# Altium project LimeSDR-QPCIe_1v2.PrjPcb (part 2 of 13)

## Sheet 06_LMS7002M_2_RF.SchDoc: LMS7002M #2 RF
size A3; Organization: Lime Microsystems; Address1: Surrey Tech Centre; Address2: Guildford GU2 7YG; Address3: Surrey; Address4: United Kingdom; Revision: v1.2; SheetNumber: 6; SheetTotal: 27
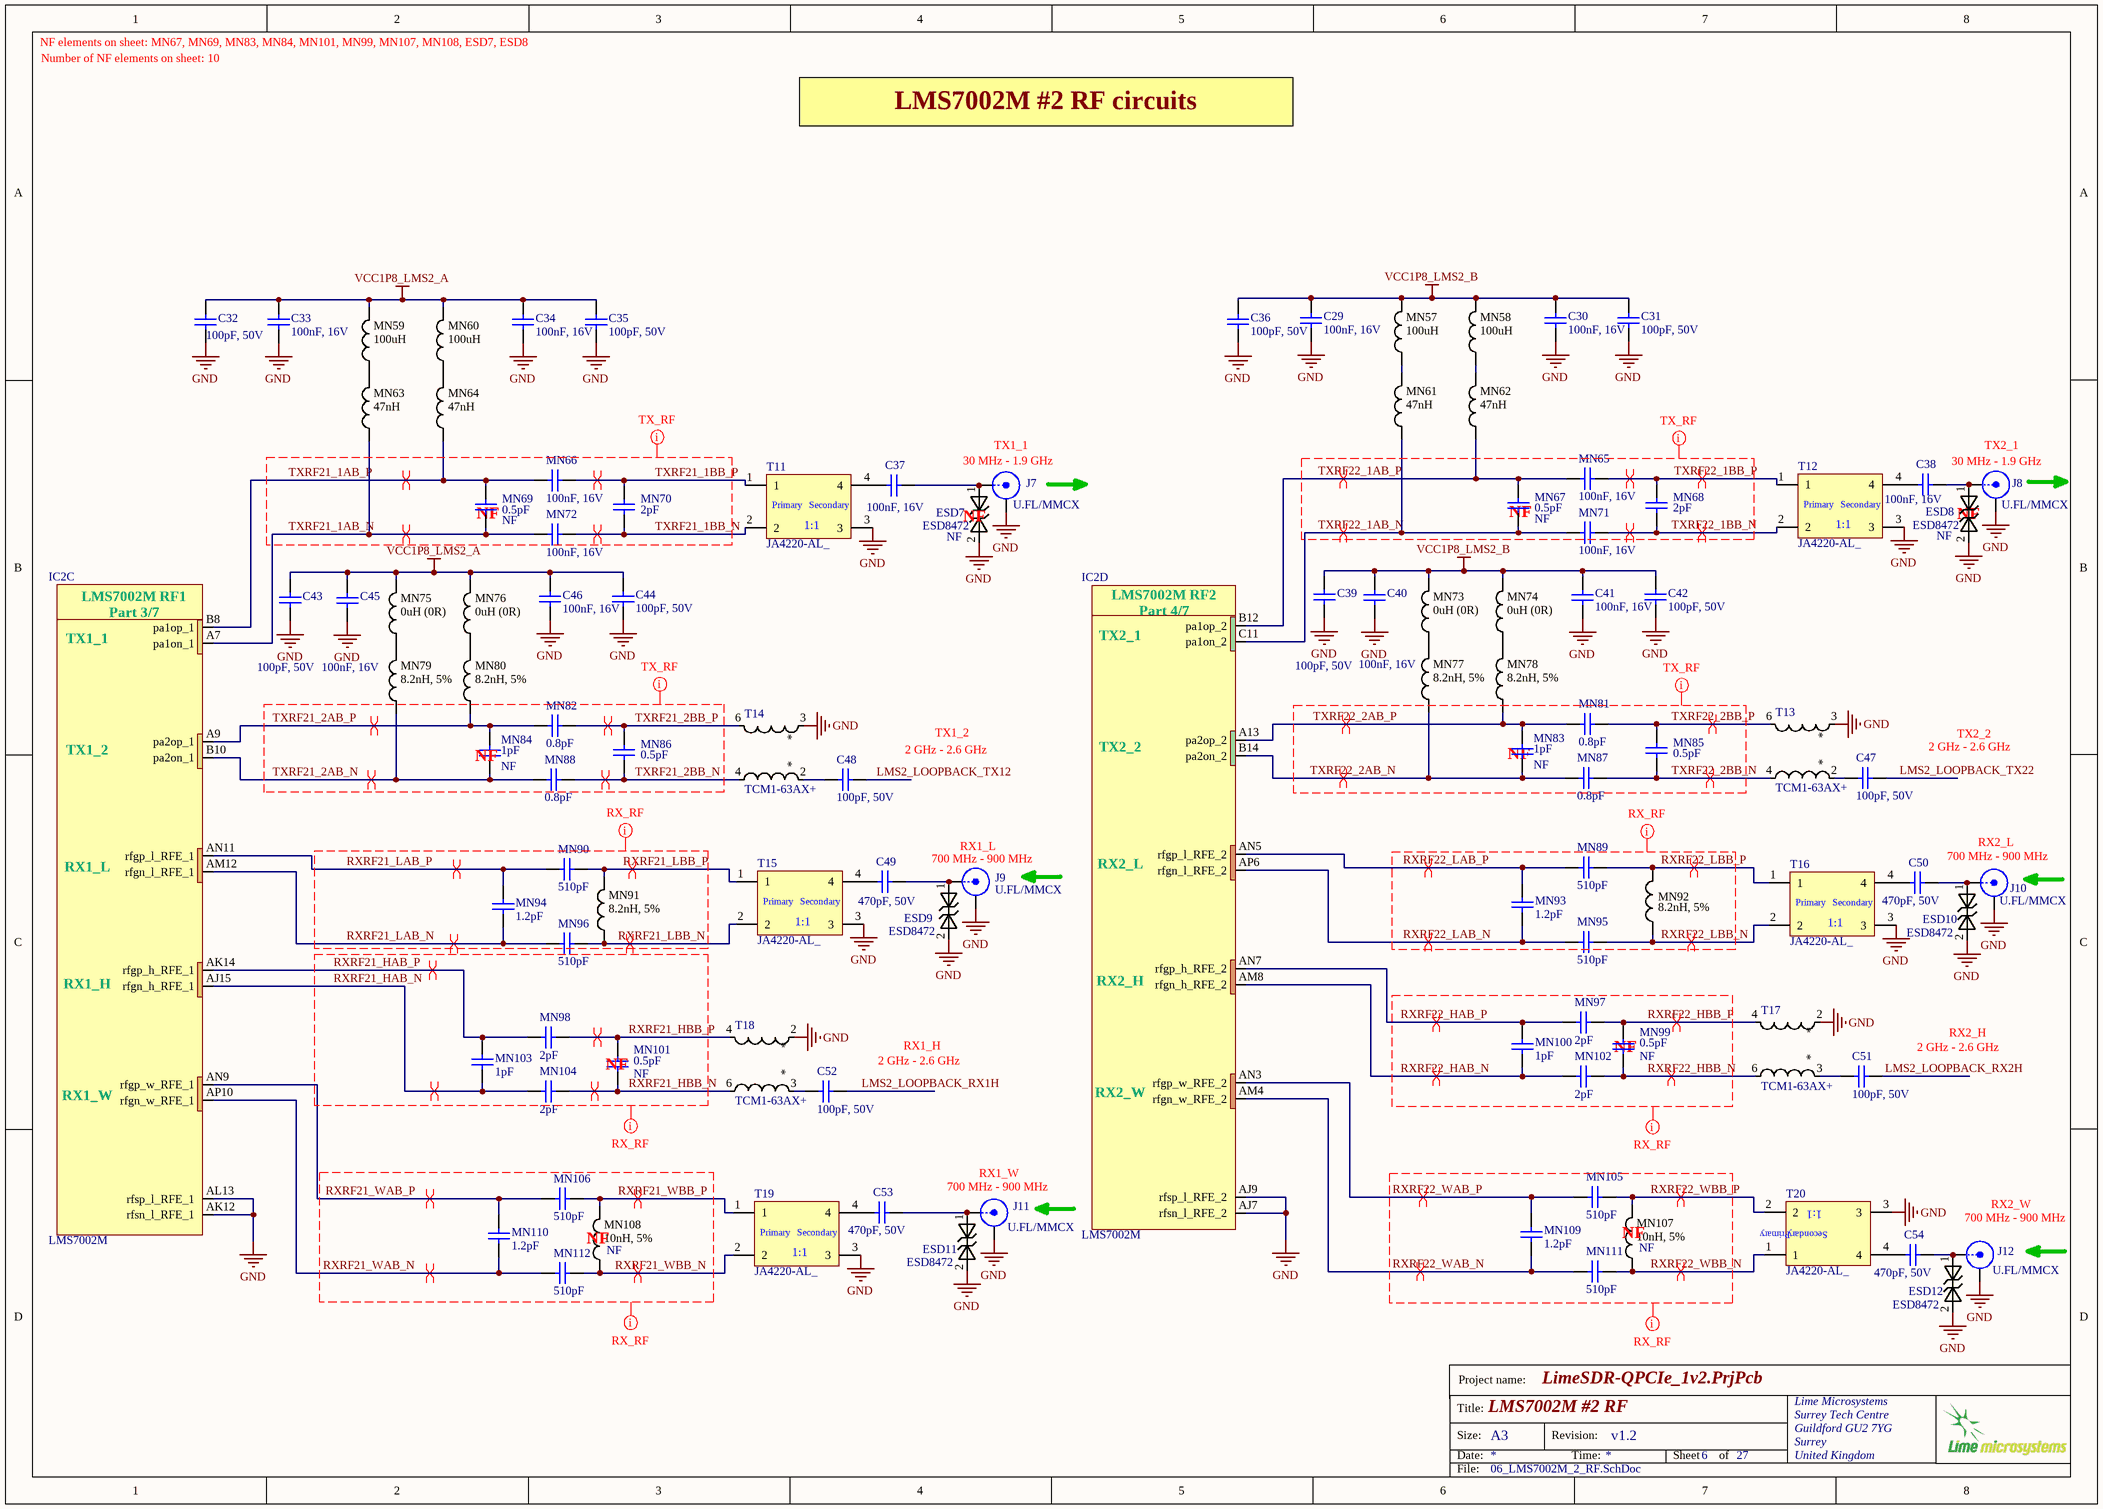
[diagram p5: 06_LMS7002M_2_RF.SchDoc]

### Parts
C29  100nF, 16V  [CAP0402]
C30  100nF, 16V  [CAP0402]
C31  100pF, 50V  [CAP0402]
C32  100pF, 50V  [CAP0402]
C33  100nF, 16V  [CAP0402]
C34  100nF, 16V  [CAP0402]
C35  100pF, 50V  [CAP0402]
C36  100pF, 50V  [CAP0402]
C37  100nF, 16V  [CAP0402]
C38  100nF, 16V  [CAP0402]
C39  100pF, 50V  [CAP0402]
C40  100nF, 16V  [CAP0402]
C41  100nF, 16V  [CAP0402]
C42  100pF, 50V  [CAP0402]
C43  100pF, 50V  [CAP0402]
C44  100pF, 50V  [CAP0402]
C45  100nF, 16V  [CAP0402]
C46  100nF, 16V  [CAP0402]
C47  100pF, 50V  [CAP0402]
C48  100pF, 50V  [CAP0402]
C49  470pF, 50V  [CAP0402]
C50  470pF, 50V  [CAP0402]
C51  100pF, 50V  [CAP0402]
C52  100pF, 50V  [CAP0402]
C53  470pF, 50V  [CAP0402]
C54  470pF, 50V  [CAP0402]
ESD7  ESD8472  Assembly Info: NF  [ESD8472_X3DFN2]
ESD8  ESD8472  Assembly Info: NF  [ESD8472_X3DFN2]
ESD9  ESD8472  [ESD8472_X3DFN2]
ESD10  ESD8472  [ESD8472_X3DFN2]
ESD11  ESD8472  [ESD8472_X3DFN2]
ESD12  ESD8472  [ESD8472_X3DFN2]
IC2  LMS7002M  [LMS7002M_v4]  (parts C,D of 7)
J7  U.FL/MMCX  [MMCX_UFL_conn_u]
J8  U.FL/MMCX  [MMCX_UFL_conn_u]
J9  U.FL/MMCX  [MMCX_UFL_conn_u]
J10  U.FL/MMCX  [MMCX_UFL_conn_u]
J11  U.FL/MMCX  [MMCX_UFL_conn_u]
J12  U.FL/MMCX  [MMCX_UFL_conn_u]
MN57  100uH  [RES0805]
MN58  100uH  [RES0805]
MN59  100uH  [RES0805]
MN60  100uH  [RES0805]
MN61  47nH  [RES0402]
MN62  47nH  [RES0402]
MN63  47nH  [RES0402]
MN64  47nH  [RES0402]
MN65  100nF, 16V  [CAP0402]
MN66  100nF, 16V  [CAP0402]
MN67  0.5pF  Assembly Info: NF  [CAP0402]
MN68  2pF  [CAP0402]
MN69  0.5pF  Assembly Info: NF  [CAP0402]
MN70  2pF  [CAP0402]
MN71  100nF, 16V  [CAP0402]
MN72  100nF, 16V  [CAP0402]
MN73  0uH (0R)  [RES0805]
MN74  0uH (0R)  [RES0805]
MN75  0uH (0R)  [RES0805]
MN76  0uH (0R)  [RES0805]
MN77  8.2nH, 5%  [RES0402]
MN78  8.2nH, 5%  [RES0402]
MN79  8.2nH, 5%  [RES0402]
MN80  8.2nH, 5%  [RES0402]
MN81  0.8pF  [CAP0402]
MN82  0.8pF  [CAP0402]
MN83  1pF  Assembly Info: NF  [CAP0402]
MN84  1pF  Assembly Info: NF  [CAP0402]
MN85  0.5pF  [CAP0402]
MN86  0.5pF  [CAP0402]
MN87  0.8pF  [CAP0402]
MN88  0.8pF  [CAP0402]
MN89  510pF  [CAP0402]
MN90  510pF  [CAP0402]
MN91  8.2nH, 5%  [RES0402]
MN92  8.2nH, 5%  [RES0402]
MN93  1.2pF  [CAP0402]
MN94  1.2pF  [CAP0402]
MN95  510pF  [CAP0402]
MN96  510pF  [CAP0402]
MN97  2pF  [CAP0402]
MN98  2pF  [CAP0402]
MN99  0.5pF  Assembly Info: NF  [CAP0402]
MN100  1pF  [CAP0402]
MN101  0.5pF  Assembly Info: NF  [CAP0402]
MN102  2pF  [CAP0402]
MN103  1pF  [CAP0402]
MN104  2pF  [CAP0402]
MN105  510pF  [CAP0402]
MN106  510pF  [CAP0402]
MN107  10nH, 5%  Assembly Info: NF  [RES0402]
MN108  10nH, 5%  Assembly Info: NF  [RES0402]
MN109  1.2pF  [CAP0402]
MN110  1.2pF  [CAP0402]
MN111  510pF  [CAP0402]
MN112  510pF  [CAP0402]
T11  JA4220-AL_  [JA4220-AL_]
T12  JA4220-AL_  [JA4220-AL_]
T13  TCM1-63AX+  [TCM1-63AX+_v2]
T14  TCM1-63AX+  [TCM1-63AX+_v2]
T15  JA4220-AL_  [JA4220-AL_]
T16  JA4220-AL_  [JA4220-AL_]
T17  TCM1-63AX+  [TCM1-63AX+_v2]
T18  TCM1-63AX+  [TCM1-63AX+_v2]
T19  JA4220-AL_  [JA4220-AL_]
T20  JA4220-AL_  [JA4220-AL_]

### Nets
GND: C29.1 C30.1 C31.2 C32.2 C33.1 C34.1 C35.2 C36.2 C39.2 C40.1 C41.1 C42.2 C43.2 C44.2 C45.1 C46.1 ESD7.2 ESD8.2 ESD9.2 ESD10.2 ESD11.2 ESD12.2 IC2.AJ7(rfsn_l_RFE_2) IC2.AJ9(rfsp_l_RFE_2) IC2.AK12(rfsn_l_RFE_1) IC2.AL13(rfsp_l_RFE_1) J7.2(Y) J8.2(Y) J9.2(Y) J10.2(Y) J11.2(Y) J12.2(Y) T11.3 T12.3 T13.3 T14.3 T15.3 T16.3 T17.2 T18.2 T19.3 T20.3
VCC1P8_LMS2_A: C32.1 C33.2 C34.2 C35.1 C43.1 C44.1 C45.2 C46.2 MN59.2 MN60.2 MN75.2 MN76.2
VCC1P8_LMS2_B: C29.2 C30.2 C31.1 C36.1 C39.1 C40.2 C41.2 C42.1 MN57.2 MN58.2 MN73.2 MN74.2
LMS2_LOOPBACK_RX1H: C52.1
LMS2_LOOPBACK_RX2H: C51.1
LMS2_LOOPBACK_TX12: C48.1
LMS2_LOOPBACK_TX22: C47.1
RXRF21_HAB_N: IC2.AJ15(rfgn_h_RFE_1) MN103.1 MN104.2
RXRF21_HAB_P: IC2.AK14(rfgp_h_RFE_1) MN98.2 MN103.2
RXRF21_HBB_N: MN101.1 MN104.1 T18.6
RXRF21_HBB_P: MN98.1 MN101.2 T18.4
RXRF21_LAB_N: IC2.AM12(rfgn_l_RFE_1) MN94.1 MN96.2
RXRF21_LAB_P: IC2.AN11(rfgp_l_RFE_1) MN90.2 MN94.2
RXRF21_LBB_N: MN91.1 MN96.1 T15.2
RXRF21_LBB_P: MN90.1 MN91.2 T15.1
RXRF21_WAB_N: IC2.AP10(rfgn_w_RFE_1) MN110.2 MN112.2
RXRF21_WAB_P: IC2.AN9(rfgp_w_RFE_1) MN106.2 MN110.1
RXRF21_WBB_N: MN108.1 MN112.1 T19.2
RXRF21_WBB_P: MN106.1 MN108.2 T19.1
RXRF22_HAB_N: IC2.AM8(rfgn_h_RFE_2) MN100.1 MN102.2
RXRF22_HAB_P: IC2.AN7(rfgp_h_RFE_2) MN97.2 MN100.2
RXRF22_HBB_N: MN99.1 MN102.1 T17.6
RXRF22_HBB_P: MN97.1 MN99.2 T17.4
RXRF22_LAB_N: IC2.AP6(rfgn_l_RFE_2) MN93.1 MN95.2
RXRF22_LAB_P: IC2.AN5(rfgp_l_RFE_2) MN89.2 MN93.2
RXRF22_LBB_N: MN92.1 MN95.1 T16.2
RXRF22_LBB_P: MN89.1 MN92.2 T16.1
RXRF22_WAB_N: IC2.AM4(rfgn_w_RFE_2) MN109.2 MN111.2
RXRF22_WAB_P: IC2.AN3(rfgp_w_RFE_2) MN105.2 MN109.1
RXRF22_WBB_N: MN107.1 MN111.1 T20.1
RXRF22_WBB_P: MN105.1 MN107.2 T20.2
TXRF21_1AB_N: IC2.A7(pa1on_1) MN63.1 MN69.1 MN72.1
TXRF21_1AB_P: IC2.B8(pa1op_1) MN64.1 MN66.2 MN69.2
TXRF21_1BB_N: MN70.1 MN72.2 T11.2
TXRF21_1BB_P: MN66.1 MN70.2 T11.1
TXRF21_2AB_N: IC2.B10(pa2on_1) MN79.1 MN84.2 MN88.2
TXRF21_2AB_P: IC2.A9(pa2op_1) MN80.1 MN82.2 MN84.1
TXRF21_2BB_N: MN86.1 MN88.1 T14.4
TXRF21_2BB_P: MN82.1 MN86.2 T14.6
TXRF22_1AB_N: IC2.C11(pa1on_2) MN61.1 MN67.1 MN71.1
TXRF22_1AB_P: IC2.B12(pa1op_2) MN62.1 MN65.2 MN67.2
TXRF22_1BB_N: MN68.1 MN71.2 T12.2
TXRF22_1BB_P: MN65.1 MN68.2 T12.1
TXRF22_2AB_N: IC2.B14(pa2on_2) MN77.1 MN83.2 MN87.2
TXRF22_2AB_P: IC2.A13(pa2op_2) MN78.1 MN81.2 MN83.1
TXRF22_2BB_N: MN85.1 MN87.1 T13.4
TXRF22_2BB_P: MN81.1 MN85.2 T13.6
NetC37_1: C37.1 ESD7.1 J7.1(X)
NetC37_2: C37.2 T11.4
NetC38_1: C38.1 ESD8.1 J8.1(X)
NetC38_2: C38.2 T12.4
NetC47_2: C47.2 T13.2
NetC48_2: C48.2 T14.2
NetC49_1: C49.1 ESD9.1 J9.1(X)
NetC49_2: C49.2 T15.4
NetC50_1: C50.1 ESD10.1 J10.1(X)
NetC50_2: C50.2 T16.4
NetC51_2: C51.2 T17.3
NetC52_2: C52.2 T18.3
NetC53_1: C53.1 ESD11.1 J11.1(X)
NetC53_2: C53.2 T19.4
NetC54_1: C54.1 ESD12.1 J12.1(X)
NetC54_2: C54.2 T20.4
NetMN57_1: MN57.1 MN61.2
NetMN58_1: MN58.1 MN62.2
NetMN59_1: MN59.1 MN63.2
NetMN60_1: MN60.1 MN64.2
NetMN73_1: MN73.1 MN77.2
NetMN74_1: MN74.1 MN78.2
NetMN75_1: MN75.1 MN79.2
NetMN76_1: MN76.1 MN80.2

### Layout directives
differential pair: RXRF21_HAB_N, RXRF21_HAB_P, RXRF21_HBB_N, RXRF21_HBB_P, RXRF21_LAB_N, RXRF21_LAB_P, RXRF21_LBB_N, RXRF21_LBB_P, RXRF21_WAB_N, RXRF21_WAB_P, RXRF21_WBB_N, RXRF21_WBB_P, RXRF22_HAB_N, RXRF22_HAB_P, RXRF22_HBB_N, RXRF22_HBB_P, RXRF22_LAB_N, RXRF22_LAB_P, RXRF22_LBB_N, RXRF22_LBB_P, RXRF22_WAB_N, RXRF22_WAB_P, RXRF22_WBB_N, RXRF22_WBB_P, TXRF21_1AB_N, TXRF21_1AB_P, TXRF21_1BB_N, TXRF21_1BB_P, TXRF21_2AB_N, TXRF21_2AB_P, TXRF21_2BB_N, TXRF21_2BB_P, TXRF22_1AB_N, TXRF22_1AB_P, TXRF22_1BB_N, TXRF22_1BB_P, TXRF22_2AB_N, TXRF22_2AB_P, TXRF22_2BB_N, TXRF22_2BB_P
net class TX_RF: TXRF21_1AB_N, TXRF21_1AB_P, TXRF21_1BB_N, TXRF21_1BB_P, TXRF21_2AB_N, TXRF21_2AB_P, TXRF21_2BB_N, TXRF21_2BB_P, TXRF22_1AB_N, TXRF22_1AB_P, TXRF22_1BB_N, TXRF22_1BB_P, TXRF22_2AB_N, TXRF22_2AB_P, TXRF22_2BB_N, TXRF22_2BB_P
net class RX_RF: RXRF21_HAB_N, RXRF21_HAB_P, RXRF21_HBB_N, RXRF21_HBB_P, RXRF21_LAB_N, RXRF21_LAB_P, RXRF21_LBB_N, RXRF21_LBB_P, RXRF21_WAB_N, RXRF21_WAB_P, RXRF21_WBB_N, RXRF21_WBB_P, RXRF22_HAB_N, RXRF22_HAB_P, RXRF22_HBB_N, RXRF22_HBB_P, RXRF22_LAB_N, RXRF22_LAB_P, RXRF22_LBB_N, RXRF22_LBB_P, RXRF22_WAB_N, RXRF22_WAB_P, RXRF22_WBB_N, RXRF22_WBB_P

### Notes on the sheet
- NF elements on sheet: MN67, MN69, MN83, MN84, MN101, MN99, MN107, MN108, ESD7, ESD8
- Number of NF elements on sheet: 10
- LMS7002M #2 RF circuits
- TX1_1
- TX2_1
- (near MN69) NF
- 30 MHz - 1.9 GHz
- (near MN67) NF
- NF
- (near ESD7) NF
- (near MN84) NF
- 2 GHz - 2.6 GHz
- TX1_2
- (near MN83) NF
- TX2_2
- RX1_L
- RX2_L
- 700 MHz - 900 MHz
- RX1_H
- (near MN99) NF
- (near C51) 2 GHz - 2.6 GHz
- RX2_H
- (near MN101) NF
- (near C52) 2 GHz - 2.6 GHz
- RX1_W
- (near MN108) NF
- (near MN107) NF
- RX2_W
- Project name:
- Title:
- Size:
- Date:
- A3
- Revision:
- Time:
- Sheet
- of
- File:
- (in symbol JA4220-AL_) Primary; Secondary; 1:1
- (in symbol LMS7002Mr3, part C) LMS7002M RF1; Part 3/7; TX1_1; TX1_2; RX1_L; RX1_H; RX1_W
- (in symbol LMS7002Mr3, part D) LMS7002M RF2; Part 4/7; TX2_1; TX2_2; RX2_L; RX2_H; RX2_W

### Library data of the parts
C29 C30 C33 C34 C37 C38 C40 C41 C45 C46 = Cap_0402: Manufacturer: Murata Electronics; Manufacturer Part Number: GRM155R71C104KA88D; Part Description: 0.10µF ±10% 16V Ceramic Capacitor X7R 0402 (1005 Metric); Tolerance: 10 %; Type: General Purpose MLCC; Capacitance: 0.1 uF; Case Length: 1 mm; Dielectric: X7R; Case Height: 0.5 mm; Temperature Coefficient / Code: +/- 15 %; Value: 100nF, 16V; Supplier 1: Mouser; Supplier Part Number 1: 81-GRM155R71C104KA88; Case Code - in: 0402; RoHS: RoHS Compliant; Operating Temperature Range: - 55 C to + 125 C; Series: GRM; Termination Style: SMD/SMT; Package / Case: 0402 (1005 metric); Voltage Rating DC: 16 V; Maximum Operating Temperature: + 125 C; Case Code - mm: 1005; Minimum Operating Temperature: - 55 C; Product Category: Low & Medium Capacitance SMD Ceramic Chip Capacitors; Packaging: Reel; Product: General Type MLCCs; Category: Multilayer Ceramic Capacitors MLCC - SMD/SMT; Brand: Murata Electronics; Case Width: 0.5 mm; RoHS - Mouser: Y; Standard Pack Qty: 10000; Minimum Order Quantity: 1; Reeling: True; Manufacturer Part Number 1: GRM155R71C104KA88D
C31 C32 C35 C36 C39 C42-C44 = Cap_0402: Manufacturer: Yageo; Manufacturer Part Number 1: CC0402JRNPO9BN101; Part Description: 100pF ±5% 50V C0G, NP0 Ceramic Capacitor -55°C ~ 125°C Surface Mount, MLCC 0402 (1005 Metric) 0.039" L x 0.020" W (1.00mm x 0.50mm); Temperature Coefficient: C0G, NP0; Tolerance: ±5%; Value: 100pF, 50V; Supplier 1: Digi-Key; Supplier Part Number 1: 311-1024-1-ND; Category: Capacitors; Features: -; Operating Temperature: -55°C ~ 125°C; Capacitance: 100pF; Thickness (Max): 0.022" (0.55mm); RoHS: RoHS Compliant; Voltage - Rated: 50V; Lead Style: -; Ratings: -; Size / Dimension: 0.039" L x 0.020" W (1.00mm x 0.50mm); Height - Seated (Max): -; Applications: General Purpose; Package / Case: 0402 (1005 Metric); Lead Spacing: -; Packaging: Tape & Reel (TR); Mounting Type: Surface Mount, MLCC
C47 C48 C51 C52 = Cap_0402: Manufacturer Part Number 1: CC0402JRNPO9BN101; Manufacturer: Yageo; Part Description: 100pF ±5% 50V C0G, NP0 Ceramic Capacitor -55°C ~ 125°C Surface Mount, MLCC 0402 (1005 Metric) 0.039" L x 0.020" W (1.00mm x 0.50mm); Tolerance: ±5%; Temperature Coefficient: C0G, NP0; Value: 100pF, 50V; Capacitance: 100pF; Thickness (Max): 0.022" (0.55mm); Size / Dimension: 0.039" L x 0.020" W (1.00mm x 0.50mm); RoHS: RoHS Compliant; Ratings: -; Package / Case: 0402 (1005 Metric); Mounting Type: Surface Mount, MLCC; Height - Seated (Max): -; Features: -; Lead Spacing: -; Voltage - Rated: 50V; Operating Temperature: -55°C ~ 125°C; Packaging: Cut Tape (CT); Applications: General Purpose; Lead Style: -; Supplier 1: Digi-Key; Category: Capacitors; Supplier Part Number 1: 311-1024-1-ND
C49 C50 C53 C54 = Cap_0402: Manufacturer Part Number: C1005C0G1H471J050BA; Manufacturer: TDK Corporation; Part Description: 470pF ±5% 50V Ceramic Capacitor C0G, NP0 0402 (1005 Metric); Tolerance: ±5%; Temperature Coefficient: C0G, NP0; Value: 470pF, 50V; Supplier 1: Digi-Key; Supplier Part Number 1: 445-2656-6-ND; Ratings: -; Package / Case: 0402 (1005 Metric); Capacitance: 470pF; Packaging: Digi-Reel®; RoHS: RoHS Compliant; Lead Style: -; Thickness (Max): 0.022" (0.55mm); Size / Dimension: 0.039" L x 0.020" W (1.00mm x 0.50mm); Lead Spacing: -; Operating Temperature: -55°C ~ 125°C; Height - Seated (Max): -; Applications: General Purpose; Mounting Type: Surface Mount, MLCC; Voltage - Rated: 50V; Category: Capacitors; Features: -
ESD7-ESD12 = ESD8472: Manufacturer: ON Semiconductor; Manufacturer Part Number: ESD8472MUT5G; Part Description: TVS DIODE 5.3VWM 14VC X3DFN2; Voltage - Reverse Standoff (Typ): 5.3V (Max); Voltage - Breakdown (Min): 7V; Voltage - Clamping (Max) @ Ipp: 14V; Current - Peak Pulse (10/1000µs): 3A (8/20µs); Power Line Protection: No; Capacitance @ Frequency: 0.2pF @ 1MHz; Supplier 1: Digi-Key; RoHS: RoHS Compliant; Category: Circuit Protection; Stock 1: 2295; Pricing 1: 1=0.39, 10=0.315, 100=0.2142, 500=0.16068, 1000=0.12051 (USD); Packaging: Cut Tape (CT); Part Status: Active; Type: Zener; Power - Peak Pulse: -; Applications: Automotive, RF Antenna; Operating Temperature: -55°C ~ 150°C (TJ); Mounting Type: Surface Mount; Package / Case: 2-XFDFN; Supplier Device Package: 2-X3DFN (0.62x0.32); ComponentLink1URL: http://www.onsemi.com/pub/Collateral/ESD8472-D.PDF; ComponentLink1Description: http://www.onsemi.com/pub/Collateral/ESD8472-D.PDF; Supplier Part Number 1: ESD8472MUT5GOSCT-ND
IC2 = LMS7002Mr3: as IC1 on sheet 04_LMS7002M_Digital; Supplier 1: Lime Microsystems; Supplier Part Number 1: LMS7002M; Manufacturer Part Number 1: LMS7002M
J7-J12 = RF_IF_connector: CONN UMC RCPT STR 50 OHM SMD; Manufacturer: Molex, LLC; Manufacturer Part Number 1: 0734120110; Part Description: Ultra Miniature Coaxial Connector Receptacle, Male Pin 50 Ohm Surface Mount Solder; Body Finish: Nickel; Body Material: Phosphor Bronze; Center Contact Material: Brass; Center Contact Plating: Gold; Connector Style: Ultra Miniature Coaxial; Connector Type: Jack, Male Pin; Contact Termination: Solder; Dielectric Material: Liquid Crystal Polymer (LCP); Frequency - Max: 6GHz; Impedance: 50 Ohm; Voltage Rating: 60V; Cable Group: -; Category: Connectors, Interconnects; Fastening Type: Snap-On; Features: -; Housing Color: Silver; Ingress Protection: -; Mounting Type: Surface Mount; Operating Temperature: -40°C ~ 90°C; Packaging: Cut Tape (CT); RoHS: RoHS Compliant; Shield Termination: Solder; Supplier 1: Digi-Key; Supplier Part Number 1: WM5587CT-ND
MN57-MN60 = Inductor_0603: Manufacturer: TDK Corporation; Manufacturer Part Number: MLF2012C101KT000; Part Description: 100µH Shielded Multilayer Inductor 2mA 3.1 Ohm Max 0805 (2012 Metric); Q @ Freq: 25 @ 1MHz; Shielding: Shielded; Current Rating: 2mA; Frequency - Self Resonant: 7MHz; Frequency - Test: 1MHz; Material - Core: Ferrite; Tolerance: ±10%; Inductance: 100µH; DC Resistance (DCR): 3.1 Ohm Max; Value: 100uH; Supplier 1: Digi-Key; Supplier Part Number 1: 445-1071-1-ND; Supplier Device Package: 0805 (2012 Metric); Size / Dimension: 0.079" L x 0.049" W (2.00mm x 1.25mm); Operating Temperature: -40°C ~ 85°C; Packaging: Cut Tape (CT); RoHS: RoHS Compliant; Current - Saturation: -; Height - Seated (Max): 0.057" (1.45mm); Package / Case: 0805 (2012 Metric); Mounting Type: Surface Mount; Type: Multilayer; Category: Inductors, Coils, Chokes
MN61-MN64 = Inductor_0603: Manufacturer: COILCRAFT; Manufacturer Part Number: 0402HP-47NXJLU; Part Description: COILCRAFT  0402HP-47NXJLU  Surface Mount High Frequency Inductor, 0402HP Series, 47 nH, 420 mA, 0402 [1005 Metric], Wirewound; SVHC: No SVHC (15-Jun-2015); Inductance Tolerance: ± 5%; High Frequency Inductor Case: 0402 [1005 Metric]; Inductor Case Style: 0402 [1005 Metric]<!--FANDB--><div class="features-and-benefits-container"></div>; Inductance: 47; DC Resistance Max: 0.58; Self Resonant Frequency Min: 2.4; Product Range: 0402; DC Current Rating: 420; Inductor Construction: Wirewound; Supplier 1: Farnell; Supplier Part Number 1: 2285856; Packaging: Cut Tape; RoHS: Y-EX; value: 47nH; Manufacturer Part Number 1: 0402HP-47NXJLU
MN65 MN66 MN71 MN72 = Cap_0402: Manufacturer: Murata Electronics; Manufacturer Part Number: GRM155R71C104KA88D; Part Description: 0.10µF ±10% 16V Ceramic Capacitor X7R 0402 (1005 Metric); Tolerance: 10 %; Capacitance: 0.1 uF; Case Length: 1 mm; Dielectric: X7R; Case Height: 0.5 mm; Temperature Coefficient / Code: +/- 15 %; Value: 100nF, 16V; Supplier 1: Mouser; Supplier Part Number 1: 81-GRM155R71C104KA88; Case Code - in: 0402; RoHS: RoHS Compliant; Operating Temperature Range: - 55 C to + 125 C; Series: GRM; Termination Style: SMD/SMT; Package / Case: 0402 (1005 metric); Voltage Rating DC: 16 V; Type: General Purpose MLCC; Maximum Operating Temperature: + 125 C; Case Code - mm: 1005; Minimum Operating Temperature: - 55 C; Product Category: Low & Medium Capacitance SMD Ceramic Chip Capacitors; Packaging: Reel; Product: General Type MLCCs; Category: Multilayer Ceramic Capacitors MLCC - SMD/SMT; Brand: Murata Electronics; Case Width: 0.5 mm; RoHS - Mouser: Y; Standard Pack Qty: 10000; Minimum Order Quantity: 1; Reeling: True; Manufacturer Part Number 1: GRM155R71C104KA88D
MN67 MN69 MN85 MN86 MN99 MN101 = Cap_0402: Manufacturer: Yageo; Manufacturer Part Number 1: CC0402CRNPO9BNR50; Part Description: 0.50pF ±0.25pF 50V Ceramic Capacitor C0G, NP0 0402 (1005 Metric); Capacitance: 0.50pF; Voltage - Rated: 50V; Temperature Coefficient: C0G, NP0; Tolerance: ±0.25pF; Value: 0.5pF; Supplier 1: Digi-Key; Supplier Part Number 1: 311-1001-1-ND; RoHS: RoHS Compliant; Thickness (Max): 0.022" (0.55mm); Features: -; Height - Seated (Max): -; Lead Spacing: -; Applications: General Purpose; Packaging: Cut Tape (CT); Ratings: -; Size / Dimension: 0.039" L x 0.020" W (1.00mm x 0.50mm); Lead Style: -; Mounting Type: Surface Mount, MLCC; Operating Temperature: -55°C ~ 125°C; Package / Case: 0402 (1005 Metric); Category: Capacitors
MN68 MN70 MN97 MN98 MN102 MN104 = Cap_0402: Manufacturer: AVX; Manufacturer Part Number 1: 04025U2R0BAT2A; Part Description: 2pF ±0.1pF 50V Ceramic Capacitor C0G, NP0 0402 (1005 Metric); Product Range: U Series; Voltage Rating: 50; SVHC: No SVHC (17-Dec-2014); Capacitance Tolerance: ± 0.1; Ceramic Capacitor Case: 0402 [1005 Metric]; Capacitance: 2; Dielectric Characteristic: C0G / NP0; Value: 2pF; Supplier 1: Farnell; Supplier Part Number 1: 2332536; Operating Temperature Max: 125; RoHS: YES; Operating Temperature Min: -55; Capacitance Tolerance ±: ± 0.1; Packaging: Cut Tape; MSL: MSL 1 - Unlimited
MN73-MN76 = Inductor_0603: Manufacturer: BOURNS; Manufacturer Part Number 1: CR0805-J/-000ELF; Part Description: RES SMD 0.0 OHM JUMPER 1/8W 0805; Value: 0uH (0R); Supplier 1: Farnell; Supplier Part Number 1: 2008388; RoHS: YES
MN77-MN80 MN91 MN92 = Inductor_0603: Manufacturer: COILCRAFT; Manufacturer Part Number 1: 0402HP-8N2XJLU; Part Description: Surface Mount High Frequency Inductor, 0402HP Series, 8.2 nH, 1.5 A, 0402 [1005 Metric], Wirewound; Inductor Construction: Wirewound; DC Current Rating: 1.5; Inductor Case Style: 0402 [1005 Metric]<!--FANDB--><div class="features-and-benefits-container"></div>; Self Resonant Frequency Min: 5.4; DC Resistance Max: 0.065; High Frequency Inductor Case: 0402 [1005 Metric]; SVHC: No SVHC (16-Jun-2014); Inductance: 8.2; Supplier 1: Farnell; Supplier Part Number 1: 2285826; Packaging: Cut Tape; Product Range: COILCRAFT - 0402; Inductance Tolerance: ± 5%; RoHS: Y-EX; Value: 8.2nH, 5%
MN81 MN82 MN87 MN88 = Cap_0402: Manufacturer: Murata Electronics North America; Manufacturer Part Number 1: GRM1555C1HR80BA01D; Part Description: 0.80pF ±0.1pF 50V Ceramic Capacitor C0G, NP0 0402 (1005 Metric); Temperature Coefficient: C0G, NP0; Capacitance: 0.80pF; Voltage - Rated: 50V; Tolerance: ±0.1pF; Value: 0.8pF; Applications: General Purpose; Operating Temperature: -55°C ~ 125°C; Size / Dimension: 0.039" L x 0.020" W (1.00mm x 0.50mm); Features: -; Supplier 1: Digi-Key; Height - Seated (Max): -; Category: Capacitors; Package / Case: 0402 (1005 Metric); Mounting Type: Surface Mount, MLCC; Lead Spacing: -; Thickness (Max): 0.022" (0.55mm); RoHS: RoHS Compliant; Supplier Part Number 1: 490-6269-1-ND; Packaging: Cut Tape (CT); Ratings: -; Lead Style: -
MN83 MN84 MN100 MN103 = Cap_0402: Manufacturer: TDK Corporation; Manufacturer Part Number 1: C1005C0G1H010B050BA; Part Description: 1pF ±0.1pF 50V Ceramic Capacitor C0G, NP0 0402 (1005 Metric); Voltage - Rated: 50V; Temperature Coefficient: C0G, NP0; Tolerance: ±0.1pF; Value: 1pF; Supplier 1: Digi-Key; Supplier Part Number 1: 445-4854-6-ND; Size / Dimension: 0.039" L x 0.020" W (1.00mm x 0.50mm); Lead Spacing: -; Operating Temperature: -55°C ~ 125°C; Thickness (Max): 0.022" (0.55mm); Package / Case: 0402 (1005 Metric); Features: -; Lead Style: -; Applications: General Purpose; Height - Seated (Max): -; Capacitance: 1pF; RoHS: RoHS Compliant; Mounting Type: Surface Mount, MLCC; Packaging: Digi-Reel®; Ratings: -; Category: Capacitors
MN89 MN90 MN95 MN96 MN105 MN106 MN111 MN112 = Cap_0402: Manufacturer: Murata Electronics North America; Manufacturer Part Number 1: GRM1555C1H511JA01D; Part Description: 510pF ±5% 50V Ceramic Capacitor C0G, NP0 0402 (1005 Metric); Voltage - Rated: 50V; Temperature Coefficient: C0G, NP0; Tolerance: ±5%; Value: 510pF; Supplier 1: Digi-Key; Supplier Part Number 1: 490-3237-1-ND; Height - Seated (Max): -; Features: -; Size / Dimension: 0.039" L x 0.020" W (1.00mm x 0.50mm); Applications: General Purpose; Lead Spacing: -; Package / Case: 0402 (1005 Metric); Ratings: -; Thickness (Max): 0.022" (0.55mm); Lead Style: -; Operating Temperature: -55°C ~ 125°C; Mounting Type: Surface Mount, MLCC; Capacitance: 510pF; Category: Capacitors; RoHS: RoHS Compliant; Packaging: Cut Tape (CT)
MN93 MN94 MN109 MN110 = Cap_0402: Manufacturer: Murata Electronics North America; Manufacturer Part Number 1: GRM1555C1H1R2CA01D; Part Description: 1.2pF ±0.25pF 50V Ceramic Capacitor C0G, NP0 0402 (1005 Metric); Temperature Coefficient: C0G, NP0; Voltage - Rated: 50V; Tolerance: ±0.25pF; Value: 1.2pF; Supplier 1: Digi-Key; Supplier Part Number 1: 490-5927-1-ND; Lead Style: -; Category: Capacitors; Features: -; Packaging: Cut Tape (CT); Operating Temperature: -55°C ~ 125°C; Package / Case: 0402 (1005 Metric); Applications: General Purpose; Size / Dimension: 0.039" L x 0.020" W (1.00mm x 0.50mm); Lead Spacing: -; Ratings: -; Mounting Type: Surface Mount, MLCC; RoHS: RoHS Compliant; Height - Seated (Max): -; Thickness (Max): 0.022" (0.55mm); Capacitance: 1.2pF
MN107 MN108 = Inductor_0603: Manufacturer: COILCRAFT; Part Description: Surface Mount High Frequency Inductor, 0402HP Series, 10 nH, 1.3 A, 0402 [1005 Metric], Wirewound; Manufacturer Part Number 1: 0402HP-10NXJLU; Value: 10nH, 5%; Supplier 1: Farnell; Supplier Part Number 1: 2285830; RoHS: Y-EX
T11 T12 T15 T16 T19 T20 = JA4220-AL_: Part Description: RF balun; 1:1 ratio; 3 dB bandwidth: 0.1 MHz to 3.5 GHz; 3.8mm x 3.8mm; Manufacturer: Coilcraft; Supplier 1: Coilcraft; Supplier Part Number: JA4220-AL_; Supplier Part Number 1: JA4220-AL_
T13 T14 T17 T18 = Balun_v2: Manufacturer: Mini-circuits; Part Description: BALUN WIDE BAND; Manufacturer Part Number 1: TCM1-63AX+; Supplier 1: Mini-circuits; Supplier Part Number 1: TCM1-63AX+

## Sheet 07_LMS7002M_1_Power.SchDoc: LMS7002M #1 power supply
size A3 portrait; Organization: Lime Microsystems; Address1: Surrey Tech Centre; Address2: Guildford GU2 7YG; Address3: Surrey; Address4: United Kingdom; Revision: v1.2; SheetNumber: 7; SheetTotal: 27; PageSetup: Record=PageOptions|CenterHorizontal=True|CenterVertical=True|PrintScale=0.70|XCorrection=1.00|YCorrection=1.00|PrintKind=1|BorderSize=5000000|LeftOffset=0|BottomOffset=0|Orientation=1|PaperLength=2970|PaperWidth=2100|Scale=100|PaperSource=7|PrintQuality=600|MediaType=1|DitherType=10|PrintScaleMode=1|PaperKind=A4|PaperIndex=9
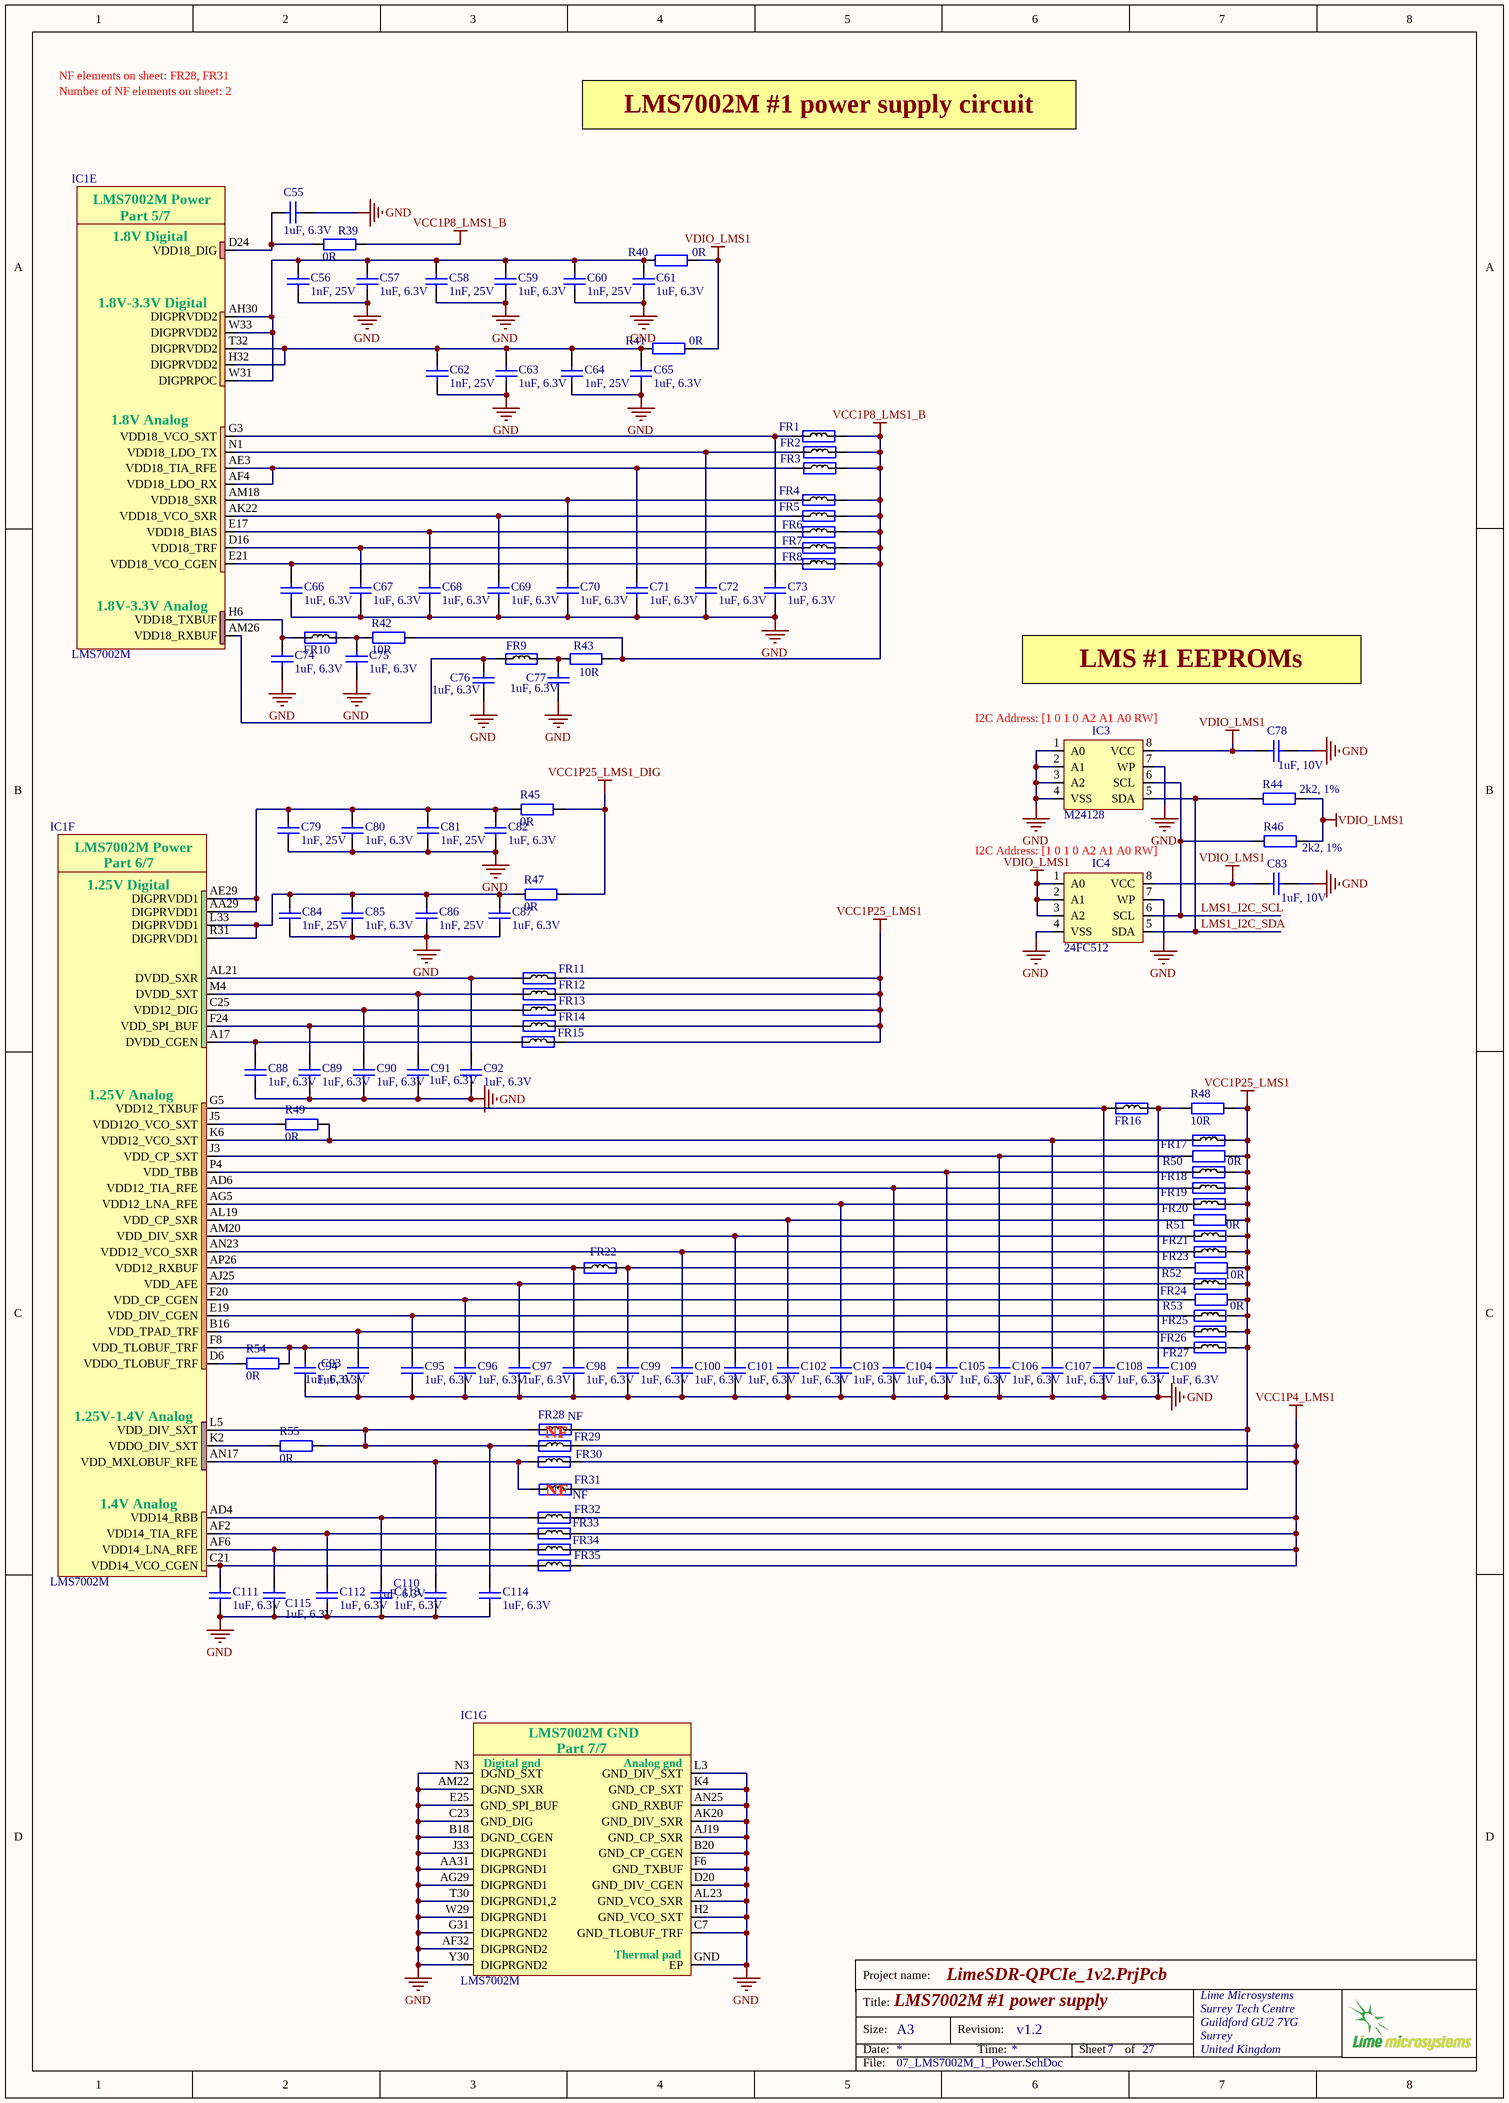
[diagram p6: 07_LMS7002M_1_Power.SchDoc]

### Parts
C55  1uF, 6.3V  [CAP0201]
C56  1nF, 25V  [CAP0201]
C57  1uF, 6.3V  [CAP0201]
C58  1nF, 25V  [CAP0201]
C59  1uF, 6.3V  [CAP0201]
C60  1nF, 25V  [CAP0201]
C61  1uF, 6.3V  [CAP0201]
C62  1nF, 25V  [CAP0201]
C63  1uF, 6.3V  [CAP0201]
C64  1nF, 25V  [CAP0201]
C65  1uF, 6.3V  [CAP0201]
C66  1uF, 6.3V  [CAP0201]
C67  1uF, 6.3V  [CAP0201]
C68  1uF, 6.3V  [CAP0201]
C69  1uF, 6.3V  [CAP0201]
C70  1uF, 6.3V  [CAP0201]
C71  1uF, 6.3V  [CAP0201]
C72  1uF, 6.3V  [CAP0201]
C73  1uF, 6.3V  [CAP0201]
C74  1uF, 6.3V  [CAP0201]
C75  1uF, 6.3V  [CAP0201]
C76  1uF, 6.3V  [CAP0201]
C77  1uF, 6.3V  [CAP0201]
C78  1uF, 10V  [CAP0402]
C79  1nF, 25V  [CAP0201]
C80  1uF, 6.3V  [CAP0201]
C81  1nF, 25V  [CAP0201]
C82  1uF, 6.3V  [CAP0201]
C83  1uF, 10V  [CAP0402]
C84  1nF, 25V  [CAP0201]
C85  1uF, 6.3V  [CAP0201]
C86  1nF, 25V  [CAP0201]
C87  1uF, 6.3V  [CAP0201]
C88  1uF, 6.3V  [CAP0201]
C89  1uF, 6.3V  [CAP0201]
C90  1uF, 6.3V  [CAP0201]
C91  1uF, 6.3V  [CAP0201]
C92  1uF, 6.3V  [CAP0201]
C93  1uF, 6.3V  [CAP0201]
C94  1uF, 6.3V  [CAP0201]
C95  1uF, 6.3V  [CAP0201]
C96  1uF, 6.3V  [CAP0201]
C97  1uF, 6.3V  [CAP0201]
C98  1uF, 6.3V  [CAP0201]
C99  1uF, 6.3V  [CAP0201]
C100  1uF, 6.3V  [CAP0201]
C101  1uF, 6.3V  [CAP0201]
C102  1uF, 6.3V  [CAP0201]
C103  1uF, 6.3V  [CAP0201]
C104  1uF, 6.3V  [CAP0201]
C105  1uF, 6.3V  [CAP0201]
C106  1uF, 6.3V  [CAP0201]
C107  1uF, 6.3V  [CAP0201]
C108  1uF, 6.3V  [CAP0201]
C109  1uF, 6.3V  [CAP0201]
C110  1uF, 6.3V  [CAP0201]
C111  1uF, 6.3V  [CAP0201]
C112  1uF, 6.3V  [CAP0201]
C113  1uF, 6.3V  [CAP0201]
C114  1uF, 6.3V  [CAP0201]
C115  1uF, 6.3V  [CAP0201]
FR1  Ferrite  [RES0201]  (value not drawn)
FR2  Ferrite  [RES0201]  (value not drawn)
FR3  Ferrite  [RES0201]  (value not drawn)
FR4  Ferrite  [RES0201]  (value not drawn)
FR5  Ferrite  [RES0201]  (value not drawn)
FR6  Ferrite  [RES0201]  (value not drawn)
FR7  Ferrite  [RES0201]  (value not drawn)
FR8  Ferrite  [RES0201]  (value not drawn)
FR9  Ferrite  [RES0201]  (value not drawn)
FR10  Ferrite  [RES0201]  (value not drawn)
FR11  Ferrite  [RES0201]  (value not drawn)
FR12  Ferrite  [RES0201]  (value not drawn)
FR13  Ferrite  [RES0201]  (value not drawn)
FR14  Ferrite  [RES0201]  (value not drawn)
FR15  Ferrite  [RES0201]  (value not drawn)
FR16  Ferrite  [RES0201]  (value not drawn)
FR17  Ferrite  [RES0201]  (value not drawn)
FR18  Ferrite  [RES0201]  (value not drawn)
FR19  Ferrite  [RES0201]  (value not drawn)
FR20  Ferrite  [RES0201]  (value not drawn)
FR21  Ferrite  [RES0201]  (value not drawn)
FR22  Ferrite  [RES0201]  (value not drawn)
FR23  Ferrite  [RES0201]  (value not drawn)
FR24  Ferrite  [RES0201]  (value not drawn)
FR25  Ferrite  [RES0201]  (value not drawn)
FR26  Ferrite  [RES0201]  (value not drawn)
FR27  Ferrite  [RES0201]  (value not drawn)
FR28  Assembly Info: NF  [RES0201]  (hidden comment: Ferrite)
FR29  Ferrite  [RES0201]  (value not drawn)
FR30  Ferrite  [RES0201]  (value not drawn)
FR31  Assembly Info: NF  [RES0201]  (hidden comment: Ferrite)
FR32  Ferrite  [RES0201]  (value not drawn)
FR33  Ferrite  [RES0201]  (value not drawn)
FR34  Ferrite  [RES0201]  (value not drawn)
FR35  Ferrite  [RES0201]  (value not drawn)
IC1  LMS7002M  [LMS7002M_v4]  (parts E,F,G of 7)
IC3  M24128  [24FC512]
IC4  24FC512  [24FC512]
R39  0R  [RES0201]
R40  0R  [RES0402]
R41  0R  [RES0402]
R42  10R  [RES0201]
R43  10R  [RES0201]
R44  2k2, 1%  [RES0402]
R45  0R  [RES0402]
R46  2k2, 1%  [RES0402]
R47  0R  [RES0402]
R48  10R  [RES0201]
R49  0R  [RES0201]
R50  0R  [RES0201]
R51  0R  [RES0201]
R52  10R  [RES0201]
R53  0R  [RES0201]
R54  0R  [RES0201]
R55  0R  [RES0201]

### Nets
GND: C55.2 C56.2 C57.2 C58.2 C59.2 C60.2 C61.2 C62.2 C63.2 C64.2 C65.2 C66.2 C67.2 C68.2 C69.2 C70.2 C71.2 C72.2 C73.2 C74.2 C75.2 C76.2 C77.2 C78.1 C79.2 C80.2 C81.2 C82.2 C83.1 C84.2 C85.2 C86.2 C87.2 C88.2 C89.2 C90.2 C91.2 C92.2 C93.2 C94.2 C95.2 C96.2 C97.2 C98.2 C99.2 C100.2 C101.2 C102.2 C103.2 C104.2 C105.2 C106.1 C107.1 C108.2 C109.2 C110.2 C111.2 C112.2 C113.2 C114.2 C115.2 IC1.AA31(DIGPRGND1) IC1.AF32(DIGPRGND2) IC1.AG29(DIGPRGND1) IC1.AJ19(GND_CP_SXR) IC1.AK20(GND_DIV_SXR) IC1.AL23(GND_VCO_SXR) IC1.AM22(DGND_SXR) IC1.AN25(GND_RXBUF) IC1.B18(DGND_CGEN) IC1.B20(GND_CP_CGEN) IC1.C7(GND_TLOBUF_TRF) IC1.C23(GND_DIG) IC1.D20(GND_DIV_CGEN) IC1.E25(GND_SPI_BUF) IC1.F6(GND_TXBUF) IC1.G31(DIGPRGND2) IC1.GND(EP) IC1.H2(GND_VCO_SXT) IC1.J33(DIGPRGND1) IC1.K4(GND_CP_SXT) IC1.L3(GND_DIV_SXT) IC1.N3(DGND_SXT) IC1.T30(DIGPRGND1,2) IC1.W29(DIGPRGND1) IC1.Y30(DIGPRGND2) IC3.1(A0) IC3.2(A1) IC3.3(A2) IC3.4(VSS) IC3.7(WP) IC4.4(VSS) IC4.7(WP)
VCC1P4_LMS1: FR29.1 FR30.2 FR32.2 FR33.2 FR34.2 FR35.2
VCC1P8_LMS1_B: FR1.2 FR2.1 FR3.1 FR4.2 FR5.2 FR6.2 FR7.2 FR8.2 R39.2 R42.2 R43.1
VCC1P25_LMS1: FR11.1 FR12.1 FR13.1 FR14.1 FR15.2 FR17.1 FR18.1 FR19.1 FR20.1 FR21.2 FR23.2 FR24.2 FR25.2 FR26.2 FR27.2 FR28.1 FR31.2 R48.2 R50.2 R51.1 R52.1 R53.1
VCC1P25_LMS1_DIG: R45.2 R47.2
VDIO_LMS1: C78.2 C83.2 IC3.8(VCC) IC4.1(A0) IC4.2(A1) IC4.3(A2) IC4.8(VCC) R40.1 R41.1 R44.1 R46.1
LMS1_I2C_SCL: IC3.6(SCL) IC4.6(SCL) R46.2
LMS1_I2C_SDA: IC3.5(SDA) IC4.5(SDA) R44.2
NetC55_1: C55.1 IC1.D24(VDD18_DIG) R39.1
NetC56_1: C56.1 C57.1 C58.1 C59.1 C60.1 C61.1 IC1.AH30(DIGPRVDD2) IC1.W31(DIGPRPOC) IC1.W33(DIGPRVDD2) R40.2
NetC62_1: C62.1 C63.1 C64.1 C65.1 IC1.H32(DIGPRVDD2) IC1.T32(DIGPRVDD2) R41.2
NetC66_1: C66.1 FR8.1 IC1.E21(VDD18_VCO_CGEN)
NetC67_1: C67.1 FR7.1 IC1.D16(VDD18_TRF)
NetC68_1: C68.1 FR6.1 IC1.E17(VDD18_BIAS)
NetC69_1: C69.1 FR5.1 IC1.AK22(VDD18_VCO_SXR)
NetC70_1: C70.1 FR4.1 IC1.AM18(VDD18_SXR)
NetC71_1: C71.1 FR3.2 IC1.AE3(VDD18_TIA_RFE) IC1.AF4(VDD18_LDO_RX)
NetC72_1: C72.1 FR2.2 IC1.N1(VDD18_LDO_TX)
NetC73_1: C73.1 FR1.1 IC1.G3(VDD18_VCO_SXT)
NetC74_1: C74.1 FR10.2 IC1.H6(VDD18_TXBUF)
NetC75_1: C75.1 FR10.1 R42.1
NetC76_1: C76.1 FR9.1 IC1.AM26(VDD18_RXBUF)
NetC77_1: C77.1 FR9.2 R43.2
NetC79_1: C79.1 C80.1 C81.1 C82.1 IC1.AA29(DIGPRVDD1) IC1.AE29(DIGPRVDD1) R45.1
NetC84_1: C84.1 C85.1 C86.1 C87.1 IC1.L33(DIGPRVDD1) IC1.R31(DIGPRVDD1) R47.1
NetC88_1: C88.1 FR15.1 IC1.A17(DVDD_CGEN)
NetC89_1: C89.1 FR14.2 IC1.F24(VDD_SPI_BUF)
NetC90_1: C90.1 FR13.2 IC1.C25(VDD12_DIG)
NetC91_1: C91.1 FR12.2 IC1.M4(DVDD_SXT)
NetC92_1: C92.1 FR11.2 IC1.AL21(DVDD_SXR)
NetC93_1: C93.1 FR26.1 IC1.B16(VDD_TPAD_TRF)
NetC94_1: C94.1 FR27.1 IC1.F8(VDD_TLOBUF_TRF) R54.1
NetC95_1: C95.1 FR25.1 IC1.E19(VDD_DIV_CGEN)
NetC96_1: C96.1 IC1.F20(VDD_CP_CGEN) R53.2
NetC97_1: C97.1 FR24.1 IC1.AJ25(VDD_AFE)
NetC98_1: C98.1 FR22.1 IC1.AP26(VDD12_RXBUF)
NetC99_1: C99.1 FR22.2 R52.2
NetC100_1: C100.1 FR23.1 IC1.AN23(VDD12_VCO_SXR)
NetC101_1: C101.1 FR21.1 IC1.AM20(VDD_DIV_SXR)
NetC102_1: C102.1 IC1.AL19(VDD_CP_SXR) R51.2
NetC103_1: C103.1 FR20.2 IC1.AG5(VDD12_LNA_RFE)
NetC104_1: C104.1 FR19.2 IC1.AD6(VDD12_TIA_RFE)
NetC105_1: C105.1 FR18.2 IC1.P4(VDD_TBB)
NetC106_2: C106.2 IC1.J3(VDD_CP_SXT) R50.1
NetC107_2: C107.2 FR17.2 IC1.K6(VDD12_VCO_SXT) R49.2
NetC108_1: C108.1 FR16.2 IC1.G5(VDD12_TXBUF)
NetC109_1: C109.1 FR16.1 R48.1
NetC110_1: C110.1 FR30.1 FR31.1 IC1.AN17(VDD_MXLOBUF_RFE)
NetC111_1: C111.1 FR35.1 IC1.C21(VDD14_VCO_CGEN)
NetC112_1: C112.1 FR33.1 IC1.AF2(VDD14_TIA_RFE)
NetC113_1: C113.1 FR32.1 IC1.AD4(VDD14_RBB)
NetC114_1: C114.1 FR28.2 FR29.2 IC1.L5(VDD_DIV_SXT) R55.2
NetC115_1: C115.1 FR34.1 IC1.AF6(VDD14_LNA_RFE)
NetIC1_D6: IC1.D6(VDDO_TLOBUF_TRF) R54.2
NetIC1_J5: IC1.J5(VDD12O_VCO_SXT) R49.1
NetIC1_K2: IC1.K2(VDDO_DIV_SXT) R55.1

### Notes on the sheet
- NF elements on sheet: FR28, FR31
- Number of NF elements on sheet: 2
- LMS7002M #1 power supply circuit
- LMS #1 EEPROMs
- (near IC3) I2C Address: [1 0 1 0 A2 A1 A0 RW]
- (near IC4) I2C Address: [1 0 1 0 A2 A1 A0 RW]
- (near FR28) NF
- (near FR31) NF
- Project name:
- Title:
- Size:
- Date:
- A3
- Revision:
- Time:
- Sheet
- of
- File:
- (in symbol LMS7002Mr3, part E) LMS7002M Power; Part 5/7; 1.8V Digital; 1.8V-3.3V Digital; 1.8V Analog; 1.8V-3.3V Analog
- (in symbol LMS7002Mr3, part F) LMS7002M Power; Part 6/7; 1.25V Digital; 1.25V Analog; 1.25V-1.4V Analog; 1.4V Analog
- (in symbol LMS7002Mr3, part G) LMS7002M GND; Part 7/7; Digital gnd; Analog gnd; Thermal pad

### Library data of the parts
C55 C57 C59 C61 C63 C65-C77 C80 C82 C85 C87-C115 = Cap_0402: Manufacturer: TDK Corporation; Manufacturer Part Number 1: C0603X5R0J105M030BC; Part Description: 1µF ±20% 6.3V Ceramic Capacitor X5R 0201 (0603 Metric); Tolerance: ±20%; Capacitance: 1.0µF; Temperature Coefficient: X5R; Value: 1uF, 6.3V; Supplier 1: Digi-Key; Supplier Part Number 1: 445-8008-1-ND; Applications: General Purpose; Features: -; Lead Style: -; Ratings: -; Thickness (Max): -; Lead Spacing: -; Height - Seated (Max): -; Size / Dimension: 0.024" L x 0.012" W (0.60mm x 0.30mm); Mounting Type: Surface Mount, MLCC; Operating Temperature: -55°C ~ 85°C; Package / Case: 0201 (0603 Metric); Packaging: Cut Tape (CT); Voltage - Rated: 6.3V; Category: Capacitors; RoHS: RoHS Compliant
C56 C58 C60 C62 C64 C79 C81 C84 C86 = Cap_0402: Manufacturer Part Number 1: C0603X7R1E102K030BA; Manufacturer: TDK Corporation; Part Description: 1000pF ±10% 25V Ceramic Capacitor X7R 0201 (0603 Metric); Temperature Coefficient: X7R; Tolerance: ±10%; Capacitance: 1000pF; Value: 1nF, 25V; Supplier 1: Digi-Key; Supplier Part Number 1: 445-7275-1-ND; Voltage - Rated: 25V; Features: -; Package / Case: 0201 (0603 Metric); Lead Spacing: -; Mounting Type: Surface Mount, MLCC; Lead Style: -; Height - Seated (Max): -; Operating Temperature: -55°C ~ 125°C; Size / Dimension: 0.024" L x 0.012" W (0.60mm x 0.30mm); Applications: General Purpose; Ratings: -; Thickness (Max): 0.013" (0.33mm); RoHS: RoHS Compliant; Packaging: Cut Tape (CT); Category: Capacitors
C78 C83 = Cap_0402: Manufacturer Part Number 1: GRM155R61A105KE15J; Manufacturer: TDK; Part Description: 1µF ±10% 10V Ceramic Capacitor X5R 0402 (1005 Metric); Voltage Rating: 10; Capacitance Tolerance: ± 10%; Product Range: TDK - C Series; Ceramic Capacitor Case: 0402 [1005 Metric]; Capacitance: 1; Dielectric Characteristic: X6; Value: 1uF, 10V; Supplier 1: Newark; Supplier Part Number 1: 490-6298-2-ND; MSL: -; RoHS: YES
FR1-FR35 = Ferrite: Manufacturer Part Number 1: BK0603TS601-T; Manufacturer: Taiyo Yuden; Part Description: FERRITE BEAD 600 OHM 0201 1LN; DC Resistance (DCR): 750 mOhm Max; Filter Type: Differential Mode - Single; Impedance @ Frequency: 600 Ohm @ 100MHz; Current Rating: 270mA; Value: 600R@100MHz; Supplier 1: Digi-Key; Supplier Part Number 1: 587-3277-1-ND; Size / Dimension: 0.024" L x 0.012" W (0.60mm x 0.30mm); Package / Case: 0201 (0603 Metric); Height (Max): 0.013" (0.33mm); Mounting Type: Surface Mount; Packaging: Cut Tape (CT); RoHS: RoHS Compliant; Category: Filters
IC1 = LMS7002Mr3: as IC1 on sheet 04_LMS7002M_Digital; Supplier 1: Lime Microsystems; Supplier Part Number 1: LMS7002M; Manufacturer Part Number 1: LMS7002M
IC3 = 24FC64F: Part Description: IC EEPROM 128KBIT 1MHZ 8TSSOP; Manufacturer: STMicroelectronics; Manufacturer Part Number 1: M24128-DRDW8TP/K; Format - Memory: EEPROMs - Serial; Memory Type: EEPROM; Memory Size: 128K (16K x 8); Speed: 1MHz; Interface: I²C, 2-Wire Serial; Voltage - Supply: 1.8 V ~ 5.5 V; Supplier 1: Digi-Key; Supplier Part Number 1: 497-15336-1-ND; RoHS: RoHS Compliant; Category: Integrated Circuits (ICs); Stock 1: 1677; Pricing 1: 1=0.47, 10=0.464, 100=0.3805, 500=0.36996, 1000=0.36005 (USD); Packaging: Cut Tape (CT); Part Status: Active; Operating Temperature: -40°C ~ 105°C (TA); Package / Case: 8-TSSOP (0.173", 4.40mm Width); Supplier Device Package: 8-TSSOP; ComponentLink1URL: http://www.st.com/content/ccc/resource/technical/document/datasheet/5c/f3/4b/70/8e/63/48/95/DM00149696.pdf/files/DM00149696.pdf/jcr:content/translations/en.DM00149696.pdf; ComponentLink1Description: http://www.st.com/content/ccc/resource/technical/document/datasheet/5c/f3/4b/70/8e/63/48/95/DM00149696.pdf/files/DM00149696.pdf/jcr:content/translations/en.DM00149696.pdf
IC4 = 24FC512: Manufacturer Part Number 1: 24FC512-I/ST; Manufacturer: Microchip Technology; Part Description: IC EEPROM 512KBIT 1MHZ 8TSSOP; Speed: 400kHz, 1MHz; Memory Type: EEPROM; Memory Size: 512K (64K x 8); Voltage - Supply: 1.7 V ~ 5.5 V; Interface: I²C, 2-Wire Serial; Format - Memory: EEPROMs - Serial; Supplier 1: Digi-Key; RoHS: RoHS Compliant; Packaging: Tube; Operating Temperature: -40°C ~ 85°C; Supplier Device Package: 8-TSSOP; Category: Integrated Circuits (ICs); Package / Case: 8-TSSOP (0.173", 4.40mm Width); Supplier Part Number 1: 24FC512-I/ST-ND
R39 R49-R51 R53-R55 = Res_0402: Manufacturer Part Number 1: MCR006YRTJ000; Manufacturer: Rohm Semiconductor; Part Description: RES SMD 0.0OHM JUMPER 1/20W 0201; Resistance (Ohms): 0.0; Power (Watts): 0.05W, 1/20W; Tolerance: Jumper; Value: 0R; Supplier 1: Digi-Key; Supplier Part Number 1: RHM0.0CCCT-ND; Number of Terminations: 2; Operating Temperature: -55°C ~ 125°C; Package / Case: 0201 (0603 Metric); Height: 0.010" (0.26mm); Supplier Device Package: 0201 (0603 Metric); Size / Dimension: 0.024" L x 0.012" W (0.60mm x 0.30mm); Temperature Coefficient: -; Category: Resistors; Features: -; RoHS: RoHS Compliant; Composition: Thick Film; Packaging: Cut Tape (CT)
R40 R41 R45 R47 = Res_0402: as R1 on sheet 04_LMS7002M_Digital; Value: 0R; Supplier 1: Digi-Key; Supplier Part Number 1: 311-0.0JRTR-ND; Category: Resistors; Temperature Coefficient: -; Features: Moisture Resistant; Supplier Device Package: 0402; Height: 0.016" (0.40mm); Package / Case: 0402 (1005 Metric); Operating Temperature: -55°C ~ 155°C; Size / Dimension: 0.039" L x 0.020" W (1.00mm x 0.50mm); Composition: Thick Film; Packaging: Tape & Reel (TR); Number of Terminations: 2; RoHS: RoHS Compliant
R42 R43 R48 R52 = Res_0402: Manufacturer: Panasonic Electronic Components; Part Description: RES SMD 10 OHM 1% 1/20W 0201; Manufacturer Part Number 1: ERJ-1GEF10R0C; Power (Watts): 0.05W, 1/20W; Resistance (Ohms): 10; Tolerance: ±1%; Temperature Coefficient: ±200ppm/°C; Value: 10R; Supplier 1: Digi-Key; Supplier Part Number 1: P10.0ABCT-ND; Package / Case: 0201 (0603 Metric); Height: 0.010" (0.26mm); Supplier Device Package: 0201; Packaging: Cut Tape (CT); Composition: Thick Film; Category: Resistors; Number of Terminations: 2; Size / Dimension: 0.024" L x 0.012" W (0.60mm x 0.30mm); Operating Temperature: -55°C ~ 125°C; Features: -; RoHS: RoHS Compliant
R44 R46 = Res_0402: Manufacturer: Stackpole Electronics Inc; Manufacturer Part Number 1: RMCF0402FT2K20; Part Description: RES SMD 2.2K OHM 1% 1/16W 0402; Resistance (Ohms): 2.2k; Temperature Coefficient: ±100ppm/°C; Power (Watts): 0.063W, 1/16W; Value: 2k2, 1%; Supplier 1: Digi-Key; Supplier Part Number 1: RMCF0402FT2K20CT-ND; Supplier Device Package: 0402; Package / Case: 0402 (1005 Metric); Size / Dimension: 0.039" L x 0.020" W (1.00mm x 0.50mm); Operating Temperature: -55°C ~ 155°C; Composition: Thick Film; Category: Resistors; Features: -; Height: 0.016" (0.40mm); RoHS: RoHS Compliant; Number of Terminations: 2; Packaging: Cut Tape (CT); Tolerance: ±1%

## Sheet 08_LMS7002M_2_Power.SchDoc: LMS7002M #2 power supply
size A3 portrait; Organization: Lime Microsystems; Address1: Surrey Tech Centre; Address2: Guildford GU2 7YG; Address3: Surrey; Address4: United Kingdom; Revision: v1.2; SheetNumber: 8; SheetTotal: 27; PageSetup: Record=PageOptions|CenterHorizontal=True|CenterVertical=True|PrintScale=0.70|XCorrection=1.00|YCorrection=1.00|PrintKind=1|BorderSize=5000000|LeftOffset=0|BottomOffset=0|Orientation=1|PaperLength=2970|PaperWidth=2100|Scale=100|PaperSource=7|PrintQuality=600|MediaType=1|DitherType=10|PrintScaleMode=1|PaperKind=A4|PaperIndex=9
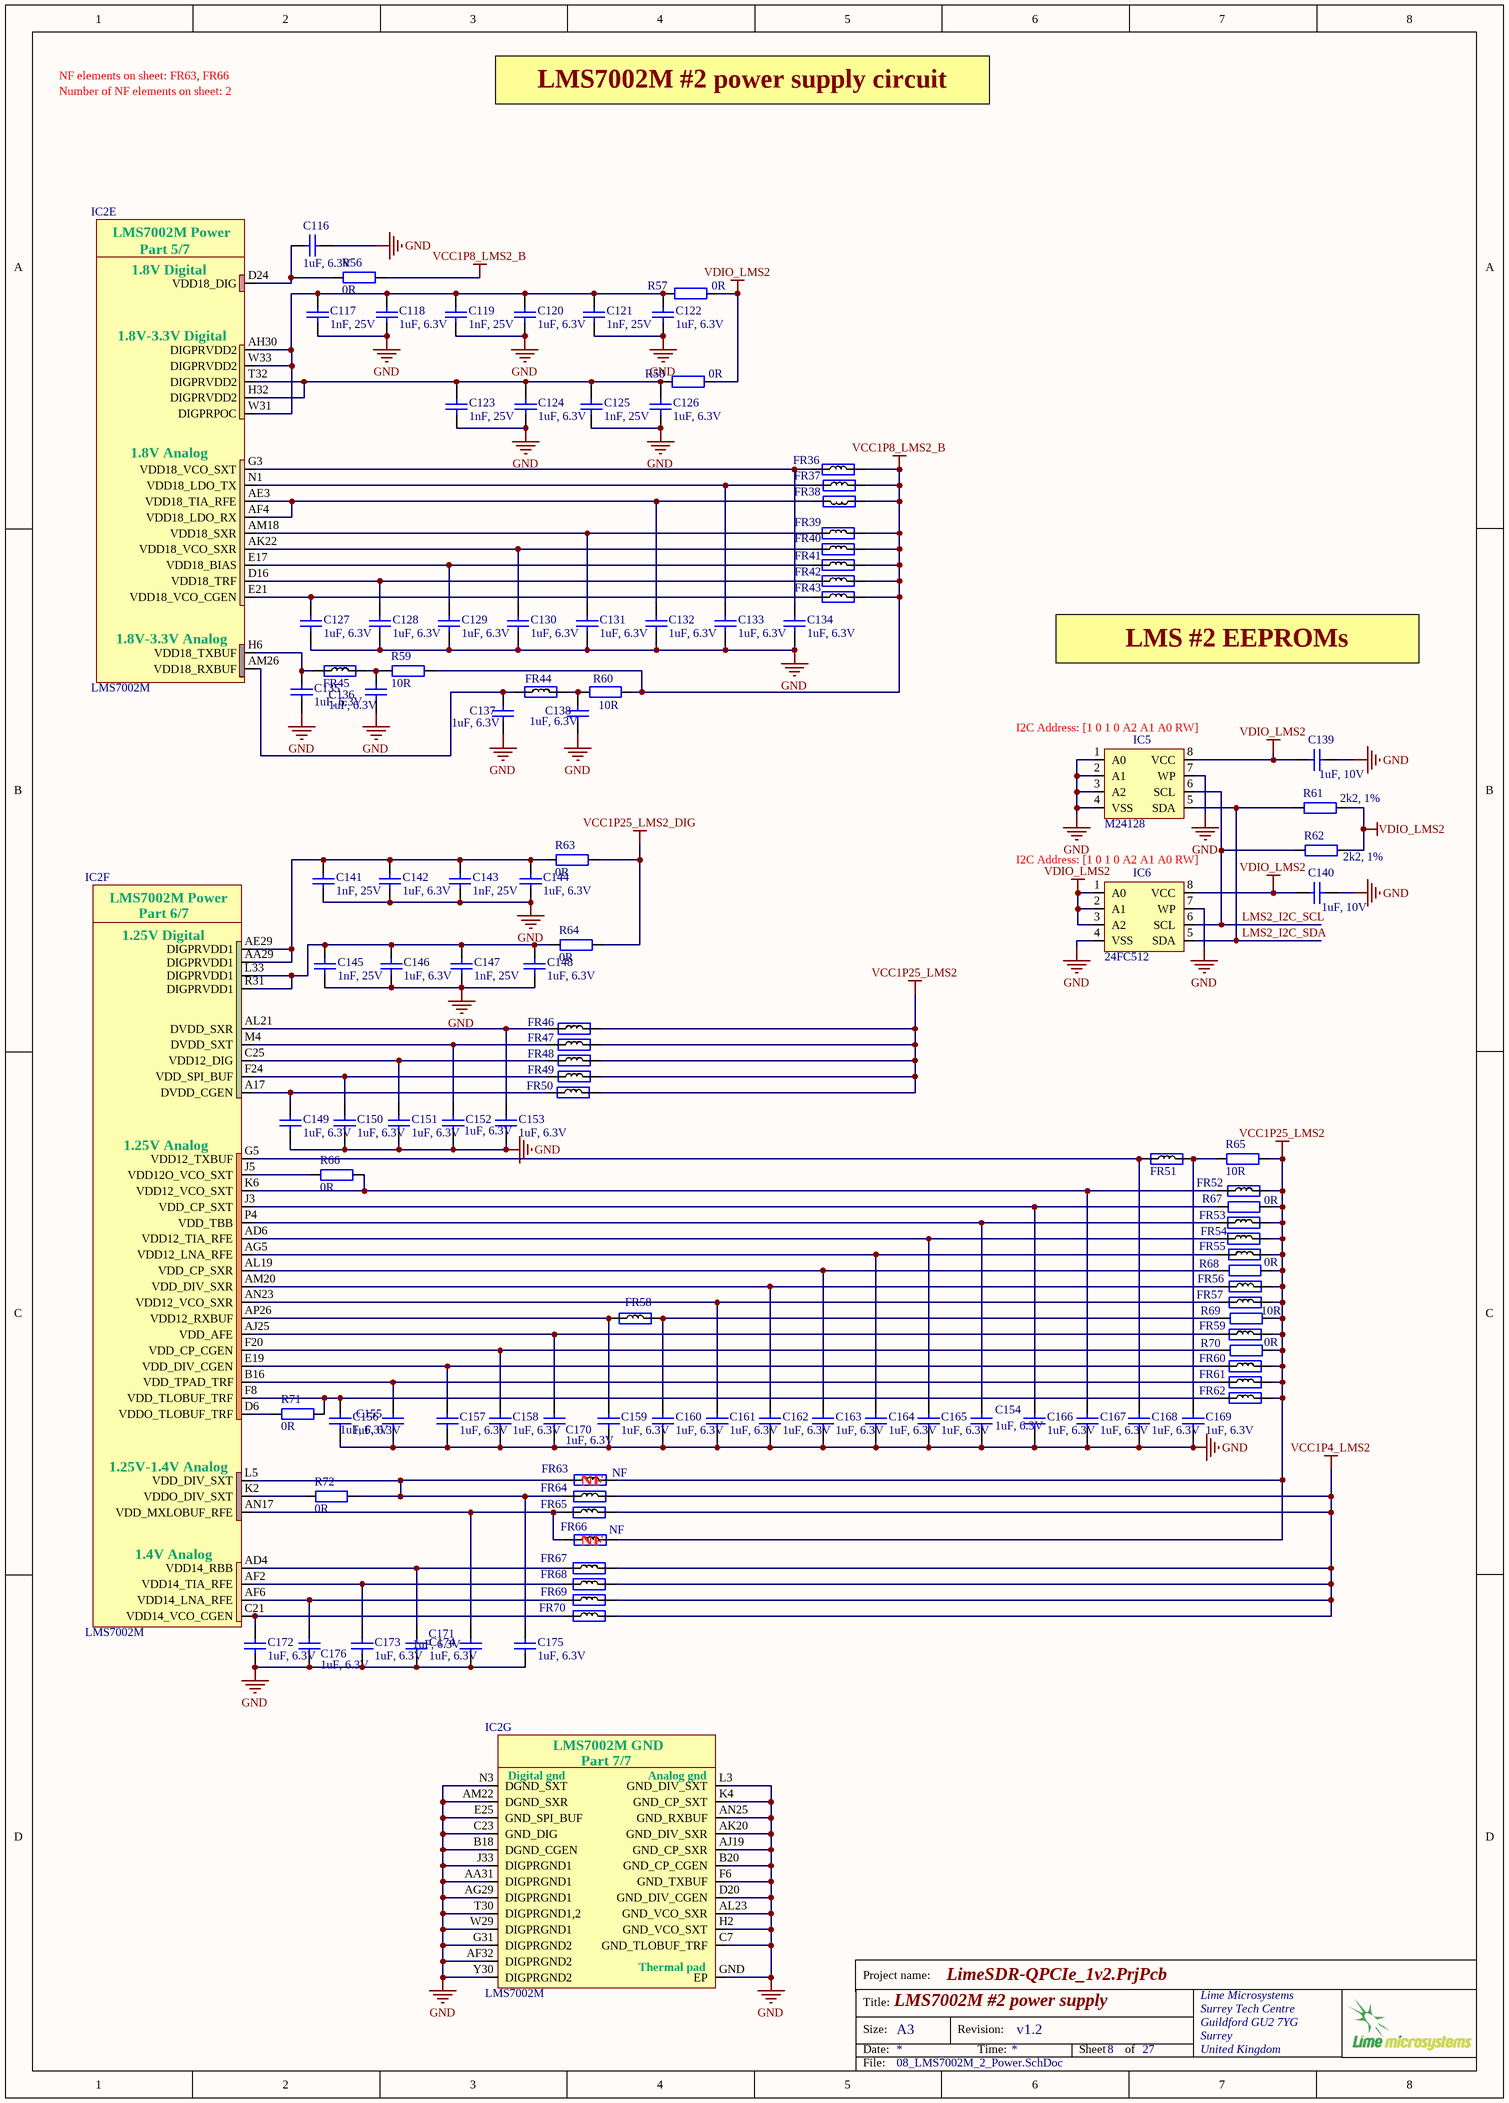
[diagram p7: 08_LMS7002M_2_Power.SchDoc]

### Parts
C116  1uF, 6.3V  [CAP0201]
C117  1nF, 25V  [CAP0201]
C118  1uF, 6.3V  [CAP0201]
C119  1nF, 25V  [CAP0201]
C120  1uF, 6.3V  [CAP0201]
C121  1nF, 25V  [CAP0201]
C122  1uF, 6.3V  [CAP0201]
C123  1nF, 25V  [CAP0201]
C124  1uF, 6.3V  [CAP0201]
C125  1nF, 25V  [CAP0201]
C126  1uF, 6.3V  [CAP0201]
C127  1uF, 6.3V  [CAP0201]
C128  1uF, 6.3V  [CAP0201]
C129  1uF, 6.3V  [CAP0201]
C130  1uF, 6.3V  [CAP0201]
C131  1uF, 6.3V  [CAP0201]
C132  1uF, 6.3V  [CAP0201]
C133  1uF, 6.3V  [CAP0201]
C134  1uF, 6.3V  [CAP0201]
C135  1uF, 6.3V  [CAP0201]
C136  1uF, 6.3V  [CAP0201]
C137  1uF, 6.3V  [CAP0201]
C138  1uF, 6.3V  [CAP0201]
C139  1uF, 10V  [CAP0402]
C140  1uF, 10V  [CAP0402]
C141  1nF, 25V  [CAP0201]
C142  1uF, 6.3V  [CAP0201]
C143  1nF, 25V  [CAP0201]
C144  1uF, 6.3V  [CAP0201]
C145  1nF, 25V  [CAP0201]
C146  1uF, 6.3V  [CAP0201]
C147  1nF, 25V  [CAP0201]
C148  1uF, 6.3V  [CAP0201]
C149  1uF, 6.3V  [CAP0201]
C150  1uF, 6.3V  [CAP0201]
C151  1uF, 6.3V  [CAP0201]
C152  1uF, 6.3V  [CAP0201]
C153  1uF, 6.3V  [CAP0201]
C154  1uF, 6.3V  [CAP0201]
C155  1uF, 6.3V  [CAP0201]
C156  1uF, 6.3V  [CAP0201]
C157  1uF, 6.3V  [CAP0201]
C158  1uF, 6.3V  [CAP0201]
C159  1uF, 6.3V  [CAP0201]
C160  1uF, 6.3V  [CAP0201]
C161  1uF, 6.3V  [CAP0201]
C162  1uF, 6.3V  [CAP0201]
C163  1uF, 6.3V  [CAP0201]
C164  1uF, 6.3V  [CAP0201]
C165  1uF, 6.3V  [CAP0201]
C166  1uF, 6.3V  [CAP0201]
C167  1uF, 6.3V  [CAP0201]
C168  1uF, 6.3V  [CAP0201]
C169  1uF, 6.3V  [CAP0201]
C170  1uF, 6.3V  [CAP0201]
C171  1uF, 6.3V  [CAP0201]
C172  1uF, 6.3V  [CAP0201]
C173  1uF, 6.3V  [CAP0201]
C174  1uF, 6.3V  [CAP0201]
C175  1uF, 6.3V  [CAP0201]
C176  1uF, 6.3V  [CAP0201]
FR36  Ferrite  [RES0201]  (value not drawn)
FR37  Ferrite  [RES0201]  (value not drawn)
FR38  Ferrite  [RES0201]  (value not drawn)
FR39  Ferrite  [RES0201]  (value not drawn)
FR40  Ferrite  [RES0201]  (value not drawn)
FR41  Ferrite  [RES0201]  (value not drawn)
FR42  Ferrite  [RES0201]  (value not drawn)
FR43  Ferrite  [RES0201]  (value not drawn)
FR44  Ferrite  [RES0201]  (value not drawn)
FR45  Ferrite  [RES0201]  (value not drawn)
FR46  Ferrite  [RES0201]  (value not drawn)
FR47  Ferrite  [RES0201]  (value not drawn)
FR48  Ferrite  [RES0201]  (value not drawn)
FR49  Ferrite  [RES0201]  (value not drawn)
FR50  Ferrite  [RES0201]  (value not drawn)
FR51  Ferrite  [RES0201]  (value not drawn)
FR52  Ferrite  [RES0201]  (value not drawn)
FR53  Ferrite  [RES0201]  (value not drawn)
FR54  Ferrite  [RES0201]  (value not drawn)
FR55  Ferrite  [RES0201]  (value not drawn)
FR56  Ferrite  [RES0201]  (value not drawn)
FR57  Ferrite  [RES0201]  (value not drawn)
FR58  Ferrite  [RES0201]  (value not drawn)
FR59  Ferrite  [RES0201]  (value not drawn)
FR60  Ferrite  [RES0201]  (value not drawn)
FR61  Ferrite  [RES0201]  (value not drawn)
FR62  Ferrite  [RES0201]  (value not drawn)
FR63  Assembly Info: NF  [RES0201]  (hidden comment: Ferrite)
FR64  Ferrite  [RES0201]  (value not drawn)
FR65  Ferrite  [RES0201]  (value not drawn)
FR66  Assembly Info: NF  [RES0201]  (hidden comment: Ferrite)
FR67  Ferrite  [RES0201]  (value not drawn)
FR68  Ferrite  [RES0201]  (value not drawn)
FR69  Ferrite  [RES0201]  (value not drawn)
FR70  Ferrite  [RES0201]  (value not drawn)
IC2  LMS7002M  [LMS7002M_v4]  (parts E,F,G of 7)
IC5  M24128  [24FC512]
IC6  24FC512  [24FC512]
R56  0R  [RES0201]
R57  0R  [RES0402]
R58  0R  [RES0402]
R59  10R  [RES0201]
R60  10R  [RES0201]
R61  2k2, 1%  [RES0402]
R62  2k2, 1%  [RES0402]
R63  0R  [RES0402]
R64  0R  [RES0402]
R65  10R  [RES0201]
R66  0R  [RES0201]
R67  0R  [RES0201]
R68  0R  [RES0201]
R69  10R  [RES0201]
R70  0R  [RES0201]
R71  0R  [RES0201]
R72  0R  [RES0201]

### Nets
GND: C116.2 C117.2 C118.2 C119.2 C120.2 C121.2 C122.2 C123.2 C124.2 C125.2 C126.2 C127.2 C128.2 C129.2 C130.2 C131.2 C132.2 C133.2 C134.2 C135.2 C136.2 C137.2 C138.2 C139.1 C140.1 C141.2 C142.2 C143.2 C144.2 C145.2 C146.2 C147.2 C148.2 C149.2 C150.2 C151.2 C152.2 C153.2 C154.2 C155.2 C156.2 C157.2 C158.2 C159.2 C160.2 C161.2 C162.2 C163.2 C164.2 C165.2 C166.2 C167.1 C168.2 C169.2 C170.2 C171.2 C172.2 C173.2 C174.2 C175.2 C176.2 IC2.AA31(DIGPRGND1) IC2.AF32(DIGPRGND2) IC2.AG29(DIGPRGND1) IC2.AJ19(GND_CP_SXR) IC2.AK20(GND_DIV_SXR) IC2.AL23(GND_VCO_SXR) IC2.AM22(DGND_SXR) IC2.AN25(GND_RXBUF) IC2.B18(DGND_CGEN) IC2.B20(GND_CP_CGEN) IC2.C7(GND_TLOBUF_TRF) IC2.C23(GND_DIG) IC2.D20(GND_DIV_CGEN) IC2.E25(GND_SPI_BUF) IC2.F6(GND_TXBUF) IC2.G31(DIGPRGND2) IC2.GND(EP) IC2.H2(GND_VCO_SXT) IC2.J33(DIGPRGND1) IC2.K4(GND_CP_SXT) IC2.L3(GND_DIV_SXT) IC2.N3(DGND_SXT) IC2.T30(DIGPRGND1,2) IC2.W29(DIGPRGND1) IC2.Y30(DIGPRGND2) IC5.1(A0) IC5.2(A1) IC5.3(A2) IC5.4(VSS) IC5.7(WP) IC6.4(VSS) IC6.7(WP)
VCC1P4_LMS2: FR64.1 FR65.2 FR67.2 FR68.2 FR69.2 FR70.2
VCC1P8_LMS2_B: FR36.2 FR37.1 FR38.1 FR39.2 FR40.2 FR41.2 FR42.2 FR43.2 R56.2 R59.2 R60.1
VCC1P25_LMS2: FR46.1 FR47.1 FR48.1 FR49.1 FR50.2 FR52.1 FR53.1 FR54.1 FR55.1 FR56.2 FR57.2 FR59.2 FR60.2 FR61.2 FR62.2 FR63.1 FR66.2 R65.2 R67.2 R68.1 R69.1 R70.1
VCC1P25_LMS2_DIG: R63.2 R64.2
VDIO_LMS2: C139.2 C140.2 IC5.8(VCC) IC6.1(A0) IC6.2(A1) IC6.3(A2) IC6.8(VCC) R57.1 R58.1 R61.1 R62.1
LMS2_I2C_SCL: IC5.6(SCL) IC6.6(SCL) R62.2
LMS2_I2C_SDA: IC5.5(SDA) IC6.5(SDA) R61.2
NetC116_1: C116.1 IC2.D24(VDD18_DIG) R56.1
NetC117_1: C117.1 C118.1 C119.1 C120.1 C121.1 C122.1 IC2.AH30(DIGPRVDD2) IC2.W31(DIGPRPOC) IC2.W33(DIGPRVDD2) R57.2
NetC123_1: C123.1 C124.1 C125.1 C126.1 IC2.H32(DIGPRVDD2) IC2.T32(DIGPRVDD2) R58.2
NetC127_1: C127.1 FR43.1 IC2.E21(VDD18_VCO_CGEN)
NetC128_1: C128.1 FR42.1 IC2.D16(VDD18_TRF)
NetC129_1: C129.1 FR41.1 IC2.E17(VDD18_BIAS)
NetC130_1: C130.1 FR40.1 IC2.AK22(VDD18_VCO_SXR)
NetC131_1: C131.1 FR39.1 IC2.AM18(VDD18_SXR)
NetC132_1: C132.1 FR38.2 IC2.AE3(VDD18_TIA_RFE) IC2.AF4(VDD18_LDO_RX)
NetC133_1: C133.1 FR37.2 IC2.N1(VDD18_LDO_TX)
NetC134_1: C134.1 FR36.1 IC2.G3(VDD18_VCO_SXT)
NetC135_1: C135.1 FR45.2 IC2.H6(VDD18_TXBUF)
NetC136_1: C136.1 FR45.1 R59.1
NetC137_1: C137.1 FR44.1 IC2.AM26(VDD18_RXBUF)
NetC138_1: C138.1 FR44.2 R60.2
NetC141_1: C141.1 C142.1 C143.1 C144.1 IC2.AA29(DIGPRVDD1) IC2.AE29(DIGPRVDD1) R63.1
NetC145_1: C145.1 C146.1 C147.1 C148.1 IC2.L33(DIGPRVDD1) IC2.R31(DIGPRVDD1) R64.1
NetC149_1: C149.1 FR50.1 IC2.A17(DVDD_CGEN)
NetC150_1: C150.1 FR49.2 IC2.F24(VDD_SPI_BUF)
NetC151_1: C151.1 FR48.2 IC2.C25(VDD12_DIG)
NetC152_1: C152.1 FR47.2 IC2.M4(DVDD_SXT)
NetC153_1: C153.1 FR46.2 IC2.AL21(DVDD_SXR)
NetC154_1: C154.1 FR53.2 IC2.P4(VDD_TBB)
NetC155_1: C155.1 FR60.1 IC2.B16(VDD_TPAD_TRF)
NetC156_1: C156.1 FR62.1 IC2.F8(VDD_TLOBUF_TRF) R71.1
NetC157_1: C157.1 FR61.1 IC2.E19(VDD_DIV_CGEN)
NetC158_1: C158.1 IC2.F20(VDD_CP_CGEN) R70.2
NetC159_1: C159.1 FR58.1 IC2.AP26(VDD12_RXBUF)
NetC160_1: C160.1 FR58.2 R69.2
NetC161_1: C161.1 FR57.1 IC2.AN23(VDD12_VCO_SXR)
NetC162_1: C162.1 FR56.1 IC2.AM20(VDD_DIV_SXR)
NetC163_1: C163.1 IC2.AL19(VDD_CP_SXR) R68.2
NetC164_1: C164.1 FR55.2 IC2.AG5(VDD12_LNA_RFE)
NetC165_1: C165.1 FR54.2 IC2.AD6(VDD12_TIA_RFE)
NetC166_1: C166.1 IC2.J3(VDD_CP_SXT) R67.1
NetC167_2: C167.2 FR52.2 IC2.K6(VDD12_VCO_SXT) R66.2
NetC168_1: C168.1 FR51.2 IC2.G5(VDD12_TXBUF)
NetC169_1: C169.1 FR51.1 R65.1
NetC170_1: C170.1 FR59.1 IC2.AJ25(VDD_AFE)
NetC171_1: C171.1 FR65.1 FR66.1 IC2.AN17(VDD_MXLOBUF_RFE)
NetC172_1: C172.1 FR70.1 IC2.C21(VDD14_VCO_CGEN)
NetC173_1: C173.1 FR68.1 IC2.AF2(VDD14_TIA_RFE)
NetC174_1: C174.1 FR67.1 IC2.AD4(VDD14_RBB)
NetC175_1: C175.1 FR63.2 FR64.2 IC2.L5(VDD_DIV_SXT) R72.2
NetC176_1: C176.1 FR69.1 IC2.AF6(VDD14_LNA_RFE)
NetIC2_D6: IC2.D6(VDDO_TLOBUF_TRF) R71.2
NetIC2_J5: IC2.J5(VDD12O_VCO_SXT) R66.1
NetIC2_K2: IC2.K2(VDDO_DIV_SXT) R72.1

### Notes on the sheet
- NF elements on sheet: FR63, FR66
- Number of NF elements on sheet: 2
- LMS7002M #2 power supply circuit
- LMS #2 EEPROMs
- (near IC5) I2C Address: [1 0 1 0 A2 A1 A0 RW]
- (near IC6) I2C Address: [1 0 1 0 A2 A1 A0 RW]
- (near FR63) NF
- (near FR66) NF
- Project name:
- Title:
- Size:
- Date:
- A3
- Revision:
- Time:
- Sheet
- of
- File:
- (in symbol LMS7002Mr3, part E) LMS7002M Power; Part 5/7; 1.8V Digital; 1.8V-3.3V Digital; 1.8V Analog; 1.8V-3.3V Analog
- (in symbol LMS7002Mr3, part F) LMS7002M Power; Part 6/7; 1.25V Digital; 1.25V Analog; 1.25V-1.4V Analog; 1.4V Analog
- (in symbol LMS7002Mr3, part G) LMS7002M GND; Part 7/7; Digital gnd; Analog gnd; Thermal pad

### Library data of the parts
C116 C118 C120 C122 C124 C126-C138 C142 C144 C146 C148-C176 = Cap_0402: Manufacturer: TDK Corporation; Manufacturer Part Number 1: C0603X5R0J105M030BC; Part Description: 1µF ±20% 6.3V Ceramic Capacitor X5R 0201 (0603 Metric); Tolerance: ±20%; Capacitance: 1.0µF; Temperature Coefficient: X5R; Value: 1uF, 6.3V; Supplier 1: Digi-Key; Supplier Part Number 1: 445-8008-1-ND; Applications: General Purpose; Features: -; Lead Style: -; Ratings: -; Thickness (Max): -; Lead Spacing: -; Height - Seated (Max): -; Size / Dimension: 0.024" L x 0.012" W (0.60mm x 0.30mm); Mounting Type: Surface Mount, MLCC; Operating Temperature: -55°C ~ 85°C; Package / Case: 0201 (0603 Metric); Packaging: Cut Tape (CT); Voltage - Rated: 6.3V; Category: Capacitors; RoHS: RoHS Compliant
C117 C119 C121 C123 C125 C141 C143 C145 C147 = Cap_0402: Manufacturer Part Number 1: C0603X7R1E102K030BA; Manufacturer: TDK Corporation; Part Description: 1000pF ±10% 25V Ceramic Capacitor X7R 0201 (0603 Metric); Temperature Coefficient: X7R; Tolerance: ±10%; Capacitance: 1000pF; Value: 1nF, 25V; Supplier 1: Digi-Key; Supplier Part Number 1: 445-7275-1-ND; Voltage - Rated: 25V; Features: -; Package / Case: 0201 (0603 Metric); Lead Spacing: -; Mounting Type: Surface Mount, MLCC; Lead Style: -; Height - Seated (Max): -; Operating Temperature: -55°C ~ 125°C; Size / Dimension: 0.024" L x 0.012" W (0.60mm x 0.30mm); Applications: General Purpose; Ratings: -; Thickness (Max): 0.013" (0.33mm); RoHS: RoHS Compliant; Packaging: Cut Tape (CT); Category: Capacitors
C139 C140 = Cap_0402: Manufacturer Part Number 1: GRM155R61A105KE15J; Manufacturer: TDK; Part Description: 1µF ±10% 10V Ceramic Capacitor X5R 0402 (1005 Metric); Voltage Rating: 10; Capacitance Tolerance: ± 10%; Product Range: TDK - C Series; Ceramic Capacitor Case: 0402 [1005 Metric]; Capacitance: 1; Dielectric Characteristic: X6; Value: 1uF, 10V; Supplier 1: Newark; Supplier Part Number 1: 490-6298-2-ND; MSL: -; RoHS: YES
FR36-FR70 = Ferrite: Manufacturer Part Number 1: BK0603TS601-T; Manufacturer: Taiyo Yuden; Part Description: FERRITE BEAD 600 OHM 0201 1LN; DC Resistance (DCR): 750 mOhm Max; Filter Type: Differential Mode - Single; Impedance @ Frequency: 600 Ohm @ 100MHz; Current Rating: 270mA; Value: 600R@100MHz; Supplier 1: Digi-Key; Supplier Part Number 1: 587-3277-1-ND; Size / Dimension: 0.024" L x 0.012" W (0.60mm x 0.30mm); Package / Case: 0201 (0603 Metric); Height (Max): 0.013" (0.33mm); Mounting Type: Surface Mount; Packaging: Cut Tape (CT); RoHS: RoHS Compliant; Category: Filters
IC2 = LMS7002Mr3: Schematic symbol revision 3. Default footprint - 0.31mm pad; Manufacturer: Lime Microsystems; Part Description: IC FPRF Transceiver LMS7002M; 261 pin aQFN; Supplier 1: Lime Microsystems; Supplier Part Number 1: LMS7002M; Manufacturer Part Number 1: LMS7002M
IC5 = 24FC64F: Part Description: IC EEPROM 128KBIT 1MHZ 8TSSOP; Manufacturer: STMicroelectronics; Manufacturer Part Number 1: M24128-DRDW8TP/K; Format - Memory: EEPROMs - Serial; Memory Type: EEPROM; Memory Size: 128K (16K x 8); Speed: 1MHz; Interface: I²C, 2-Wire Serial; Voltage - Supply: 1.8 V ~ 5.5 V; Supplier 1: Digi-Key; Supplier Part Number 1: 497-15336-1-ND; RoHS: RoHS Compliant; Category: Integrated Circuits (ICs); Stock 1: 1677; Pricing 1: 1=0.47, 10=0.464, 100=0.3805, 500=0.36996, 1000=0.36005 (USD); Packaging: Cut Tape (CT); Part Status: Active; Operating Temperature: -40°C ~ 105°C (TA); Package / Case: 8-TSSOP (0.173", 4.40mm Width); Supplier Device Package: 8-TSSOP; ComponentLink1URL: http://www.st.com/content/ccc/resource/technical/document/datasheet/5c/f3/4b/70/8e/63/48/95/DM00149696.pdf/files/DM00149696.pdf/jcr:content/translations/en.DM00149696.pdf; ComponentLink1Description: http://www.st.com/content/ccc/resource/technical/document/datasheet/5c/f3/4b/70/8e/63/48/95/DM00149696.pdf/files/DM00149696.pdf/jcr:content/translations/en.DM00149696.pdf
IC6 = 24FC512: Manufacturer Part Number 1: 24FC512-I/ST; Manufacturer: Microchip Technology; Part Description: IC EEPROM 512KBIT 1MHZ 8TSSOP; Speed: 400kHz, 1MHz; Memory Type: EEPROM; Memory Size: 512K (64K x 8); Voltage - Supply: 1.7 V ~ 5.5 V; Interface: I²C, 2-Wire Serial; Format - Memory: EEPROMs - Serial; Supplier 1: Digi-Key; RoHS: RoHS Compliant; Packaging: Tube; Operating Temperature: -40°C ~ 85°C; Supplier Device Package: 8-TSSOP; Category: Integrated Circuits (ICs); Package / Case: 8-TSSOP (0.173", 4.40mm Width); Supplier Part Number 1: 24FC512-I/ST-ND
R56 R66-R68 R70-R72 = Res_0402: Manufacturer Part Number 1: MCR006YRTJ000; Manufacturer: Rohm Semiconductor; Part Description: RES SMD 0.0OHM JUMPER 1/20W 0201; Resistance (Ohms): 0.0; Power (Watts): 0.05W, 1/20W; Tolerance: Jumper; Value: 0R; Supplier 1: Digi-Key; Supplier Part Number 1: RHM0.0CCCT-ND; Number of Terminations: 2; Operating Temperature: -55°C ~ 125°C; Package / Case: 0201 (0603 Metric); Height: 0.010" (0.26mm); Supplier Device Package: 0201 (0603 Metric); Size / Dimension: 0.024" L x 0.012" W (0.60mm x 0.30mm); Temperature Coefficient: -; Category: Resistors; Features: -; RoHS: RoHS Compliant; Composition: Thick Film; Packaging: Cut Tape (CT)
R57 R58 R63 R64 = Res_0402: Manufacturer Part Number 1: RC0402JR-070RL; Manufacturer: Yageo; Part Description: RES SMD 0.0OHM JUMPER 1/16W 0402; Resistance (Ohms): 0.0; Tolerance: Jumper; Power (Watts): 0.063W, 1/16W; Value: 0R; Supplier 1: Digi-Key; Supplier Part Number 1: 311-0.0JRTR-ND; Category: Resistors; Temperature Coefficient: -; Features: Moisture Resistant; Supplier Device Package: 0402; Height: 0.016" (0.40mm); Package / Case: 0402 (1005 Metric); Operating Temperature: -55°C ~ 155°C; Size / Dimension: 0.039" L x 0.020" W (1.00mm x 0.50mm); Composition: Thick Film; Packaging: Tape & Reel (TR); Number of Terminations: 2; RoHS: RoHS Compliant
R59 R60 R65 R69 = Res_0402: Manufacturer: Panasonic Electronic Components; Part Description: RES SMD 10 OHM 1% 1/20W 0201; Manufacturer Part Number 1: ERJ-1GEF10R0C; Power (Watts): 0.05W, 1/20W; Resistance (Ohms): 10; Tolerance: ±1%; Temperature Coefficient: ±200ppm/°C; Value: 10R; Supplier 1: Digi-Key; Supplier Part Number 1: P10.0ABCT-ND; Package / Case: 0201 (0603 Metric); Height: 0.010" (0.26mm); Supplier Device Package: 0201; Packaging: Cut Tape (CT); Composition: Thick Film; Category: Resistors; Number of Terminations: 2; Size / Dimension: 0.024" L x 0.012" W (0.60mm x 0.30mm); Operating Temperature: -55°C ~ 125°C; Features: -; RoHS: RoHS Compliant
R61 R62 = Res_0402: Manufacturer: Stackpole Electronics Inc; Manufacturer Part Number 1: RMCF0402FT2K20; Part Description: RES SMD 2.2K OHM 1% 1/16W 0402; Resistance (Ohms): 2.2k; Temperature Coefficient: ±100ppm/°C; Power (Watts): 0.063W, 1/16W; Value: 2k2, 1%; Supplier 1: Digi-Key; Supplier Part Number 1: RMCF0402FT2K20CT-ND; Supplier Device Package: 0402; Package / Case: 0402 (1005 Metric); Size / Dimension: 0.039" L x 0.020" W (1.00mm x 0.50mm); Operating Temperature: -55°C ~ 155°C; Composition: Thick Film; Category: Resistors; Features: -; Height: 0.016" (0.40mm); RoHS: RoHS Compliant; Number of Terminations: 2; Packaging: Cut Tape (CT); Tolerance: ±1%